# Altium project Tigershark 3D.PrjPcb
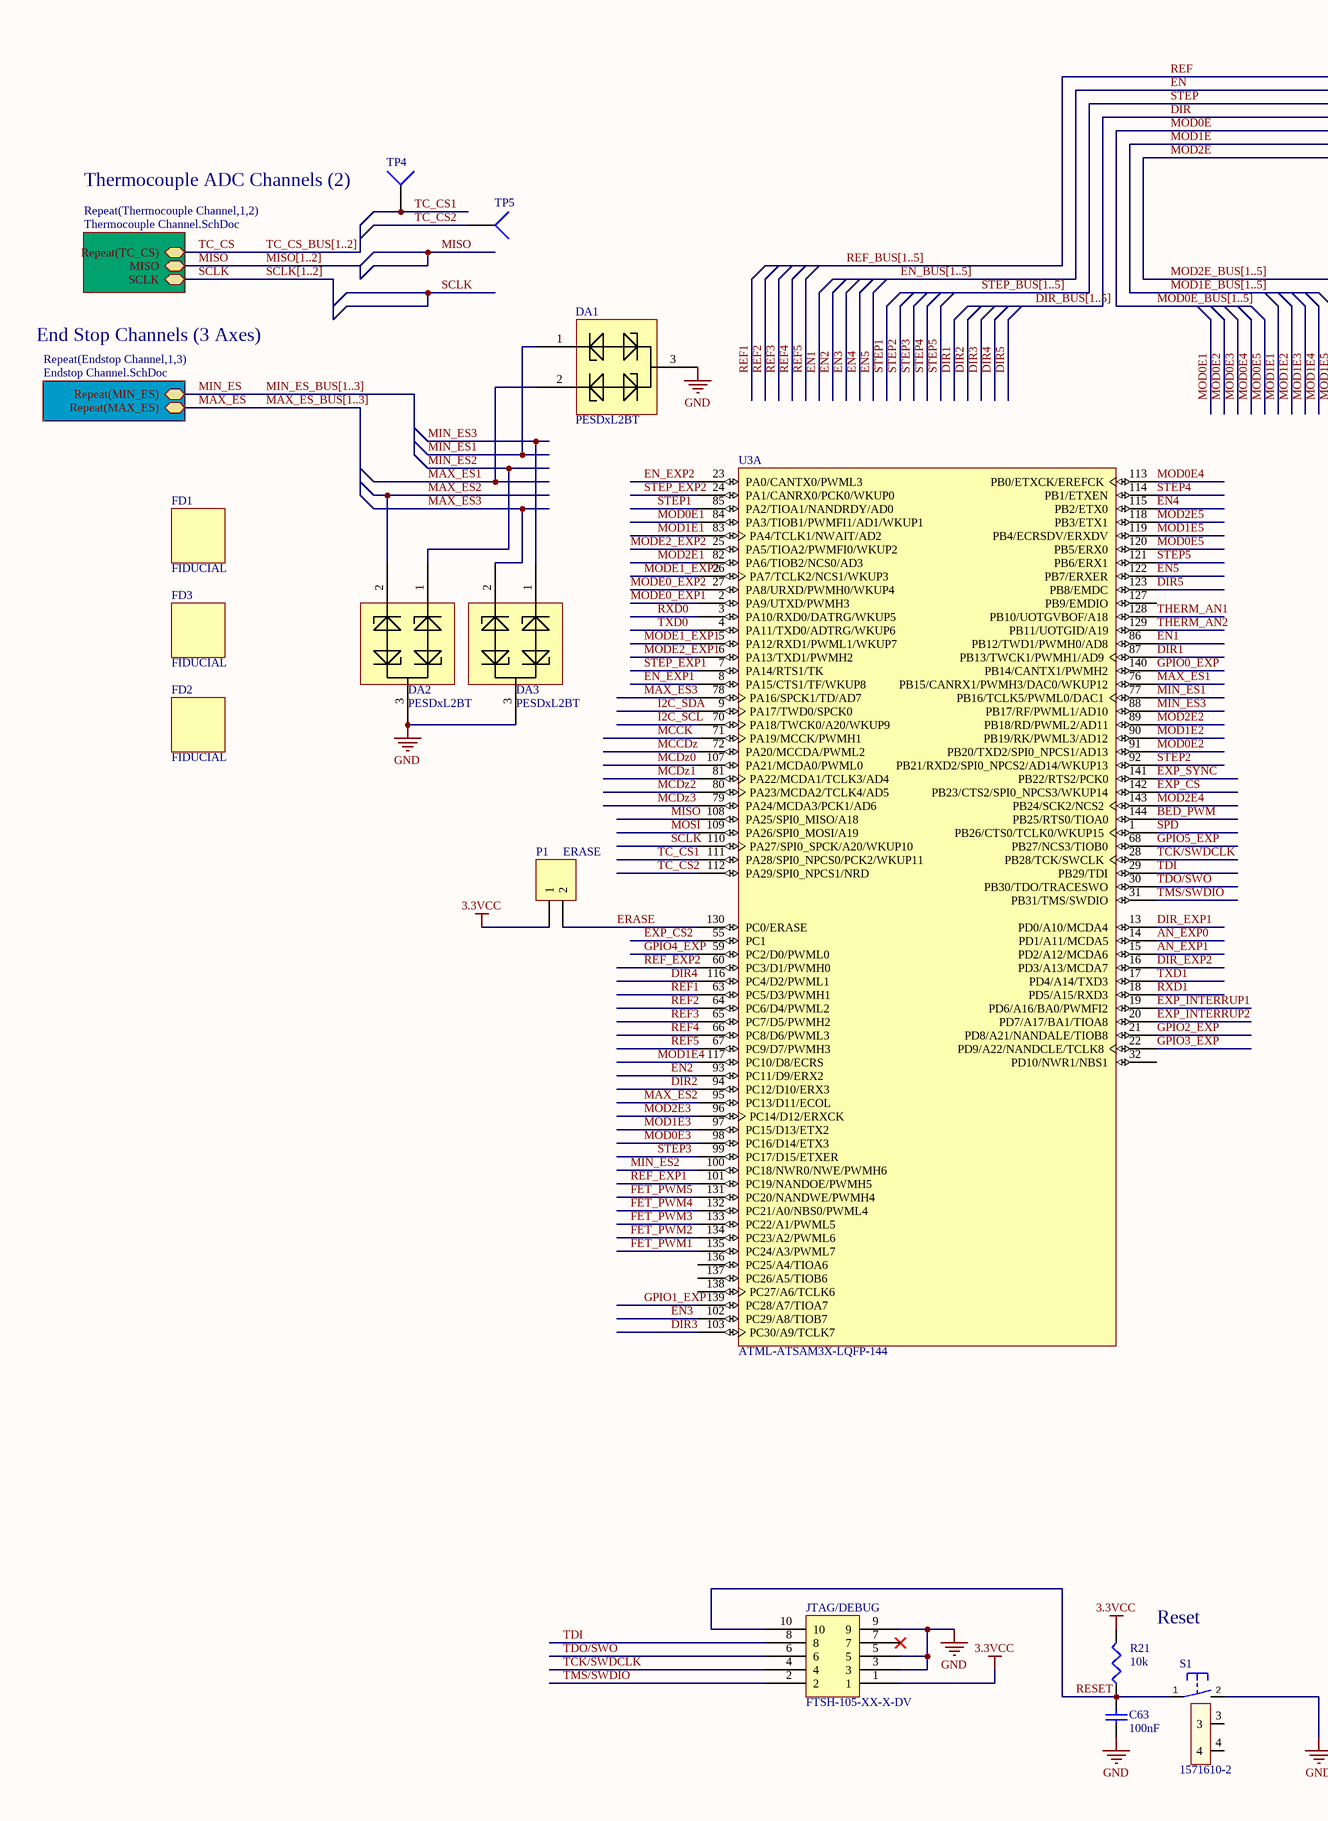
[diagram p0: ATSAM3X8E Main Controller.SchDoc, left]
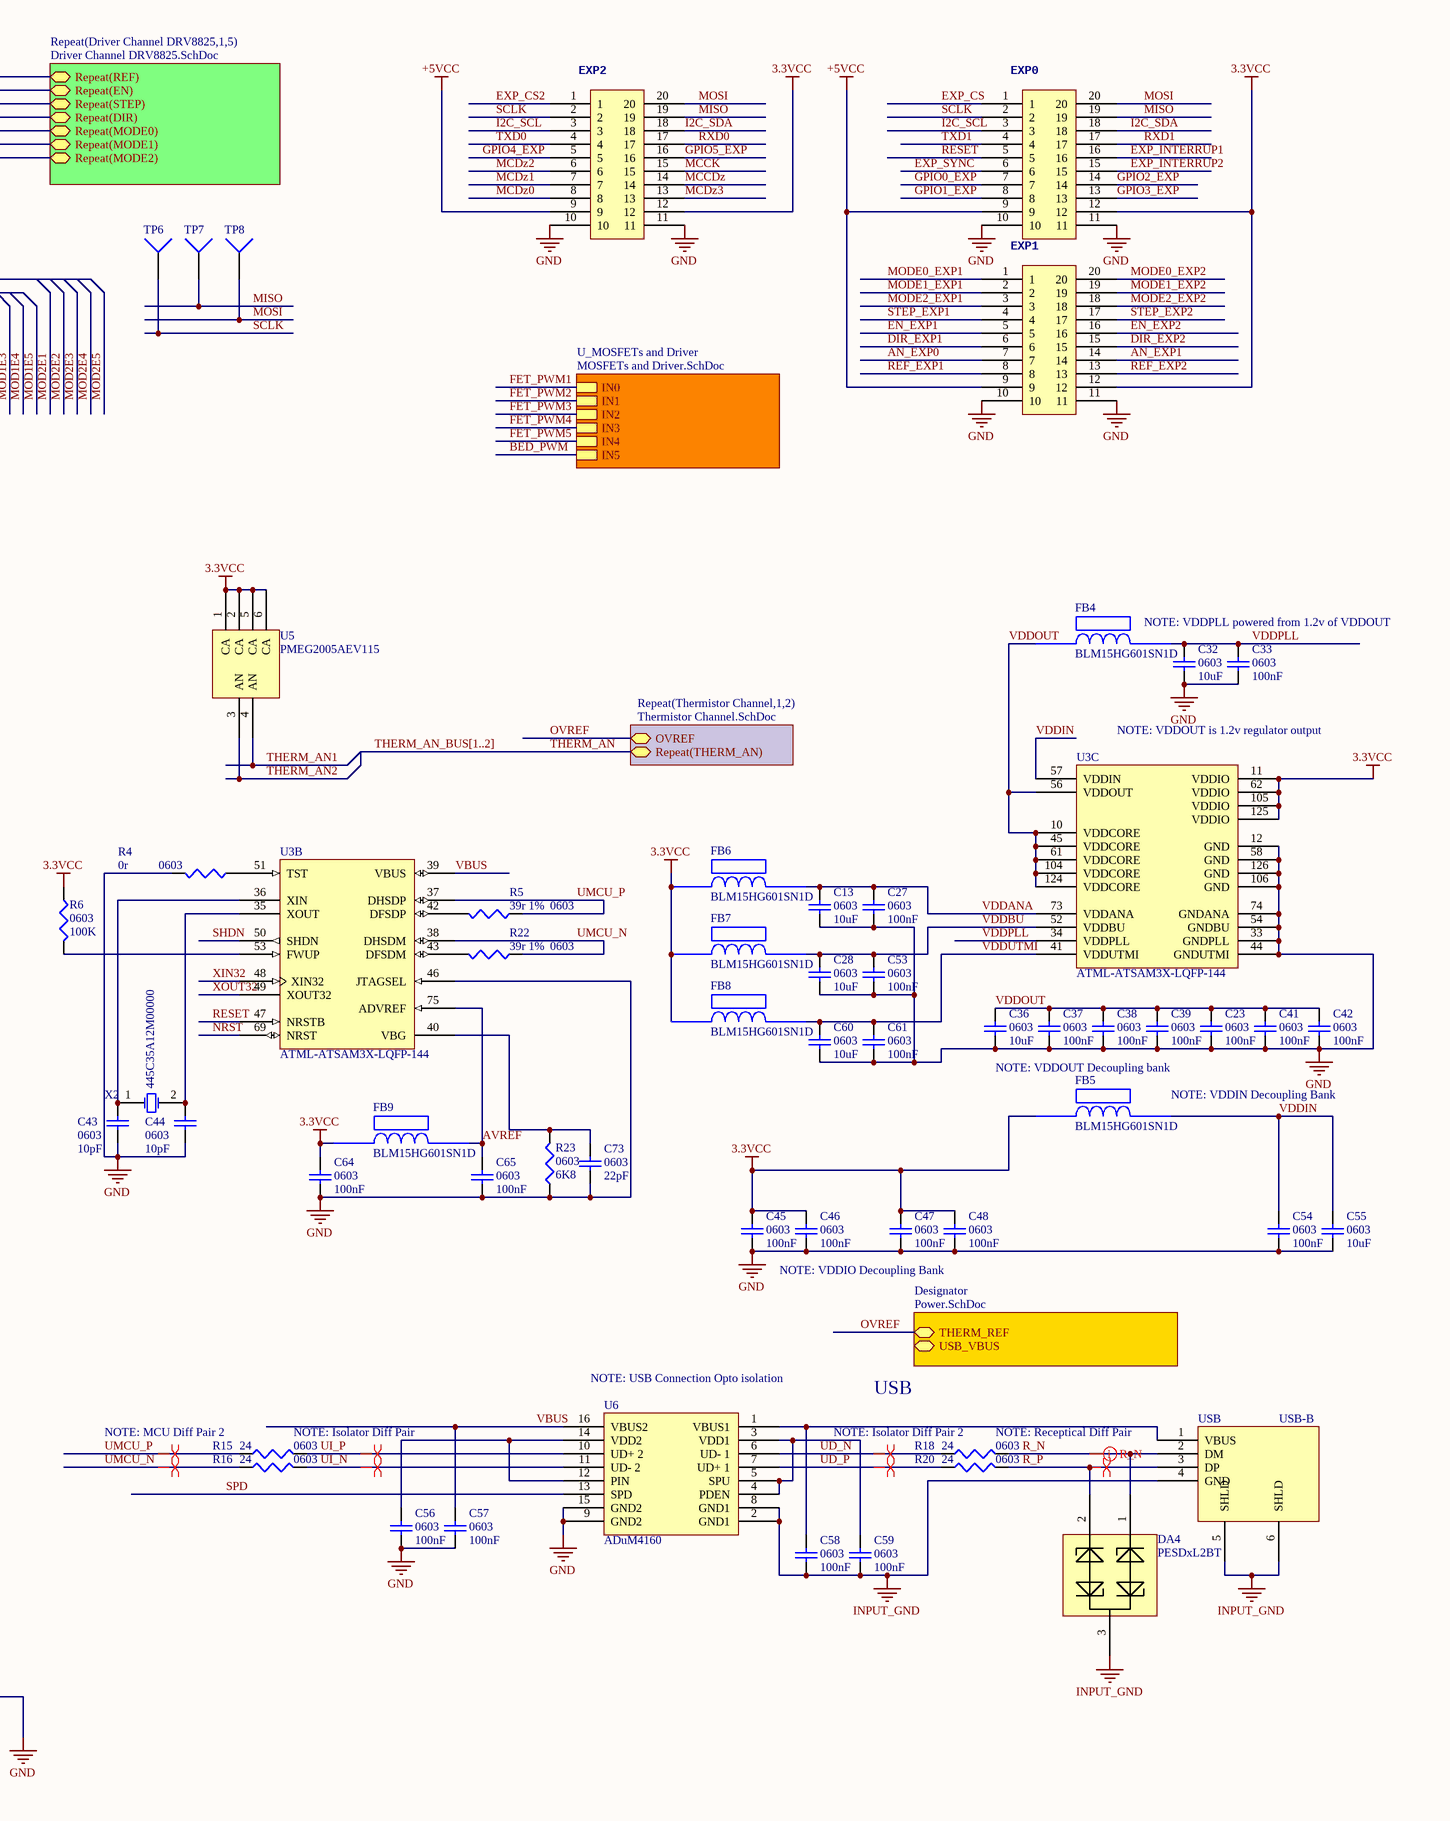
[diagram p1: ATSAM3X8E Main Controller.SchDoc, right]
7 sheets, 307 parts. Net scope: hierarchical (ports join the sheet entries above them; power ports are global).
Board file: Tigershark 3D R1.8.PcbDoc
Sheets:
  ATSAM3X8E Main Controller.SchDoc
    Thermistor Channel1 = Thermistor Channel.SchDoc
    Thermistor Channel2 = Thermistor Channel.SchDoc
    Designator = Power.SchDoc
    Thermocouple Channel1 = Thermocouple Channel.SchDoc
    Thermocouple Channel2 = Thermocouple Channel.SchDoc
    Endstop Channel1 = Endstop Channel.SchDoc
    Endstop Channel2 = Endstop Channel.SchDoc
    Endstop Channel3 = Endstop Channel.SchDoc
    Driver Channel DRV88251 = Driver Channel DRV8825.SchDoc
    Driver Channel DRV88252 = Driver Channel DRV8825.SchDoc
    Driver Channel DRV88253 = Driver Channel DRV8825.SchDoc
    Driver Channel DRV88254 = Driver Channel DRV8825.SchDoc
    Driver Channel DRV88255 = Driver Channel DRV8825.SchDoc
    U_MOSFETs and Driver = MOSFETs and Driver.SchDoc

## Sheet ATSAM3X8E Main Controller.SchDoc
size C

### Parts
(Parts that share a designator on the sheet are numbered #1, #2 ... from top to bottom, then left to right.)
C13  0603  value 10uF  [1608[0603]]
C23  0603  value 100nF  [1608[0603]]
C27  0603  value 100nF  [1608[0603]]
C28  0603  value 10uF  [1608[0603]]
C32  0603  value 10uF  [1608[0603]]
C33  0603  value 100nF  [1608[0603]]
C36  0603  value 10uF  [1608[0603]]
C37  0603  value 100nF  [1608[0603]]
C38  0603  value 100nF  [1608[0603]]
C39  0603  value 100nF  [1608[0603]]
C41  0603  value 100nF  [1608[0603]]
C42  0603  value 100nF  [1608[0603]]
C43  0603  value 10pF  [1608[0603]]
C44  0603  value 10pF  [1608[0603]]
C45  0603  value 100nF  [1608[0603]]
C46  0603  value 100nF  [1608[0603]]
C47  0603  value 100nF  [1608[0603]]
C48  0603  value 100nF  [1608[0603]]
C53  0603  value 100nF  [1608[0603]]
C54  0603  value 100nF  [1608[0603]]
C55  0603  value 10uF  [1608[0603]]
C56  0603  value 100nF  [1608[0603]]
C57  0603  value 100nF  [1608[0603]]
C58  0603  value 100nF  [1608[0603]]
C59  0603  value 100nF  [1608[0603]]
C60  0603  value 10uF  [1608[0603]]
C61  0603  value 100nF  [1608[0603]]
C63  value 100nF  [1608[0603]]  (hidden comment: Cap Semi)
C64  0603  value 100nF  [1608[0603]]
C65  0603  value 100nF  [1608[0603]]
C73  0603  value 22pF  [1608[0603]]
DA1  PESDxL2BT  [SOT95P230X110-3N]
DA2  PESDxL2BT  [SOT95P230X110-3N]
DA3  PESDxL2BT  [SOT95P230X110-3N]
DA4  PESDxL2BT  [SOT95P230X110-3N]
EXP0  10X2-0.1X0.05  [10X2-0.05X0.1w]  (value not drawn)
EXP1  10X2-0.1X0.05  [10X2-0.05X0.1w]  (value not drawn)
EXP2  10X2-0.1X0.05  [10X2-0.05X0.1w]  (value not drawn)
FB4  BLM15HG601SN1D  [BLM18PG121SN1D]
FB5  BLM15HG601SN1D  [BLM18PG121SN1D]
FB6  BLM15HG601SN1D  [BLM18PG121SN1D]
FB7  BLM15HG601SN1D  [BLM18PG121SN1D]
FB8  BLM15HG601SN1D  [BLM18PG121SN1D]
FB9  BLM15HG601SN1D  [BLM18PG121SN1D]
FD1  FIDUCIAL  [FIDUCIAL-1X2]
FD2  FIDUCIAL  [FIDUCIAL-1X2]
FD3  FIDUCIAL  [FIDUCIAL-1X2]
JTAG/DEBUG  FTSH-105-XX-X-DV  [FTSH-105-XX-X-DV]
P1  ERASE  [HDR1X2]
R4  0603  value 0r  [J1-0603]
R5  0603  value 39r 1%  [J1-0603]
R6  0603  value 100K  [J1-0603]
R15  0603  value 24  [J1-0603]
R16  0603  value 24  [J1-0603]
R18  0603  value 24  [J1-0603]
R20  0603  value 24  [J1-0603]
R21  value 10k  [J1-0603]  (hidden comment: Res3)
R22  0603  value 39r 1%  [J1-0603]
R23  0603  value 6K8  [J1-0603]
S1  1571610-2  [B3F-31XX]
TP4  TP4  [TP-2]  (value not drawn)
TP5  TP4  [TP-2]  (value not drawn)
TP6  TP4  [TP-2]  (value not drawn)
TP7  TP4  [TP-2]  (value not drawn)
TP8  TP4  [TP-2]  (value not drawn)
U3#1  ATML-ATSAM3X-LQFP-144  [LQFP144_N]  (parts A,C of 3)
U3#2  ATML-ATSAM3X-LQFP-144  [LQFP144_N]  (part B of 3)
U5  PMEG2005AEV115  [PMEG2005AEV115]
U6  ADuM4160  [ADuM4160]
USB  USB-B  [PN61729]
X2  445C35A12M00000  [445C35A12M00000]

### Sub-sheets
Designator = Power.SchDoc: USB_VBUS (bidir), THERM_REF
Repeat(Driver Channel DRV8825,1,5) = Driver Channel DRV8825.SchDoc: Repeat(REF), Repeat(EN), Repeat(STEP), Repeat(DIR), Repeat(MODE0), Repeat(MODE1), Repeat(MODE2)
Repeat(Endstop Channel,1,3) = Endstop Channel.SchDoc: Repeat(MAX_ES), Repeat(MIN_ES)
Repeat(Thermistor Channel,1,2) = Thermistor Channel.SchDoc: OVREF, Repeat(THERM_AN)
Repeat(Thermocouple Channel,1,2) = Thermocouple Channel.SchDoc: SCLK, MISO, Repeat(TC_CS)
U_MOSFETs and Driver = MOSFETs and Driver.SchDoc: IN0, IN1, IN2, IN3, IN4, IN5

### Nets
3.3VCC: C45.2 C46.2 C47.2 C48.2 C64.2 EXP0.12 EXP1.12 EXP2.12 FB5.1 FB6.1 FB7.1 FB8.1 FB9.1 JTAG/DEBUG.1 P1.1 R6.1 R21.2 U3#1.11(VDDIO) U3#1.62(VDDIO) U3#1.105(VDDIO) U3#1.125(VDDIO) U5.1(CA) U5.2(CA) U5.5(CA) U5.6(CA)
+5VCC: EXP0.9 EXP1.9 EXP2.9
GND: C13.1 C23.1 C27.1 C28.1 C32.1 C33.1 C36.1 C37.1 C38.1 C39.1 C41.1 C42.1 C43.1 C44.1 C45.1 C46.1 C47.1 C48.1 C53.1 C54.1 C55.1 C56.1 C57.1 C60.1 C61.1 C63.1 C64.1 C65.1 C73.1 DA1.3 DA2.3 DA3.3 EXP0.10 EXP0.11 EXP1.10 EXP1.11 EXP2.10 EXP2.11 JTAG/DEBUG.3 JTAG/DEBUG.5 JTAG/DEBUG.9 R4.2 R23.1 S1.2(S) U3#1.12(GND) U3#1.33(GNDPLL) U3#1.44(GNDUTMI) U3#1.54(GNDBU) U3#1.58(GND) U3#1.74(GNDANA) U3#1.106(GND) U3#1.126(GND) U3#2.46(JTAGSEL) U6.9(GND2) U6.15(GND2)
INPUT_GND: C58.1 C59.1 DA4.3 U6.2(GND1) U6.8(GND1) USB.4(GND) USB.5(SHLD) USB.6(SHLD)
AN_EXP0: EXP1.7 U3#1.14(PD1/A11/MCDA5)
AN_EXP1: EXP1.14 U3#1.15(PD2/A12/MCDA6)
AVREF: C65.2 FB9.2 U3#2.75(ADVREF)
BED_PWM: U3#1.144(PB25/RTS0/TIOA0) ; sheet U_MOSFETs and Driver/IN5
DIR: sheet Repeat(Driver Channel DRV8825,1,5)/Repeat(DIR)
DIR1: U3#1.87(PB13/TWCK1/PWMH1/AD9)
DIR2: U3#1.94(PC12/D10/ERX3)
DIR3: U3#1.103(PC30/A9/TCLK7)
DIR4: U3#1.116(PC4/D2/PWML1)
DIR5: U3#1.123(PB8/EMDC)
DIR_EXP1: EXP1.6 U3#1.13(PD0/A10/MCDA4)
DIR_EXP2: EXP1.15 U3#1.16(PD3/A13/MCDA7)
EN: sheet Repeat(Driver Channel DRV8825,1,5)/Repeat(EN)
EN1: U3#1.86(PB12/TWD1/PWMH0/AD8)
EN2: U3#1.93(PC11/D9/ERX2)
EN3: U3#1.102(PC29/A8/TIOB7)
EN4: U3#1.115(PB2/ETX0)
EN5: U3#1.122(PB7/ERXER)
EN_EXP1: EXP1.5 U3#1.8(PA15/CTS1/TF/WKUP8)
EN_EXP2: EXP1.16 U3#1.23(PA0/CANTX0/PWML3)
ERASE: P1.2 U3#1.130(PC0/ERASE)
EXP_CS: EXP0.1 U3#1.142(PB23/CTS2/SPI0_NPCS3/WKUP14)
EXP_CS2: EXP2.1 U3#1.55(PC1)
EXP_INTERRUP1: EXP0.16 U3#1.19(PD6/A16/BA0/PWMFI2)
EXP_INTERRUP2: EXP0.15 U3#1.20(PD7/A17/BA1/TIOA8)
EXP_SYNC: EXP0.6 U3#1.141(PB22/RTS2/PCK0)
FET_PWM1: U3#1.135(PC24/A3/PWML7) ; sheet U_MOSFETs and Driver/IN0
FET_PWM2: U3#1.134(PC23/A2/PWML6) ; sheet U_MOSFETs and Driver/IN1
FET_PWM3: U3#1.133(PC22/A1/PWML5) ; sheet U_MOSFETs and Driver/IN2
FET_PWM4: U3#1.132(PC21/A0/NBS0/PWML4) ; sheet U_MOSFETs and Driver/IN3
FET_PWM5: U3#1.131(PC20/NANDWE/PWMH4) ; sheet U_MOSFETs and Driver/IN4
GPIO0_EXP: EXP0.7 U3#1.140(PB14/CANTX1/PWMH2)
GPIO1_EXP: EXP0.8 U3#1.139(PC28/A7/TIOA7)
GPIO2_EXP: EXP0.14 U3#1.21(PD8/A21/NANDALE/TIOB8)
GPIO3_EXP: EXP0.13 U3#1.22(PD9/A22/NANDCLE/TCLK8)
GPIO4_EXP: EXP2.5 U3#1.59(PC2/D0/PWML0)
GPIO5_EXP: EXP2.16 U3#1.68(PB27/NCS3/TIOB0)
I2C_SCL: EXP0.3 EXP2.3 U3#1.70(PA18/TWCK0/A20/WKUP9)
I2C_SDA: EXP0.18 EXP2.18 U3#1.9(PA17/TWD0/SPCK0)
MAX_ES: sheet Repeat(Endstop Channel,1,3)/Repeat(MAX_ES)
MAX_ES1: DA1.2 U3#1.76(PB15/CANRX1/PWMH3/DAC0/WKUP12)
MAX_ES2: DA2.2 U3#1.95(PC13/D11/ECOL)
MAX_ES3: DA3.2 U3#1.78(PA16/SPCK1/TD/AD7)
MCCDz: EXP2.14 U3#1.72(PA20/MCCDA/PWML2)
MCCK: EXP2.15 U3#1.71(PA19/MCCK/PWMH1)
MCDz0: EXP2.8 U3#1.107(PA21/MCDA0/PWML0)
MCDz1: EXP2.7 U3#1.81(PA22/MCDA1/TCLK3/AD4)
MCDz2: EXP2.6 U3#1.80(PA23/MCDA2/TCLK4/AD5)
MCDz3: EXP2.13 U3#1.79(PA24/MCDA3/PCK1/AD6)
MIN_ES: sheet Repeat(Endstop Channel,1,3)/Repeat(MIN_ES)
MIN_ES1: DA1.1 U3#1.77(PB16/TCLK5/PWML0/DAC1)
MIN_ES2: DA2.1 U3#1.100(PC18/NWR0/NWE/PWMH6)
MIN_ES3: DA3.1 U3#1.88(PB17/RF/PWML1/AD10)
MISO: EXP0.19 EXP2.19 TP7.1 U3#1.108(PA25/SPI0_MISO/A18) ; sheet Repeat(Thermocouple Channel,1,2)/MISO
MOD0E: sheet Repeat(Driver Channel DRV8825,1,5)/Repeat(MODE0)
MOD0E1: U3#1.84(PA3/TIOB1/PWMFI1/AD1/WKUP1)
MOD0E2: U3#1.91(PB20/TXD2/SPI0_NPCS1/AD13)
MOD0E3: U3#1.98(PC16/D14/ETX3)
MOD0E4: U3#1.113(PB0/ETXCK/EREFCK)
MOD0E5: U3#1.120(PB5/ERX0)
MOD1E: sheet Repeat(Driver Channel DRV8825,1,5)/Repeat(MODE1)
MOD1E1: U3#1.83(PA4/TCLK1/NWAIT/AD2)
MOD1E2: U3#1.90(PB19/RK/PWML3/AD12)
MOD1E3: U3#1.97(PC15/D13/ETX2)
MOD1E4: U3#1.117(PC10/D8/ECRS)
MOD1E5: U3#1.119(PB4/ECRSDV/ERXDV)
MOD2E: sheet Repeat(Driver Channel DRV8825,1,5)/Repeat(MODE2)
MOD2E1: U3#1.82(PA6/TIOB2/NCS0/AD3)
MOD2E2: U3#1.89(PB18/RD/PWML2/AD11)
MOD2E3: U3#1.96(PC14/D12/ERXCK)
MOD2E4: U3#1.143(PB24/SCK2/NCS2)
MOD2E5: U3#1.118(PB3/ETX1)
MODE0_EXP1: EXP1.1 U3#1.2(PA9/UTXD/PWMH3)
MODE0_EXP2: EXP1.20 U3#1.27(PA8/URXD/PWMH0/WKUP4)
MODE1_EXP1: EXP1.2 U3#1.5(PA12/RXD1/PWML1/WKUP7)
MODE1_EXP2: EXP1.19 U3#1.26(PA7/TCLK2/NCS1/WKUP3)
MODE2_EXP1: EXP1.3 U3#1.6(PA13/TXD1/PWMH2)
MODE2_EXP2: EXP1.18 U3#1.25(PA5/TIOA2/PWMFI0/WKUP2)
MOSI: EXP0.20 EXP2.20 TP8.1 U3#1.109(PA26/SPI0_MOSI/A19)
NRST: U3#2.69(NRST)
OVREF: sheet Repeat(Thermistor Channel,1,2)/OVREF, sheet Designator/THERM_REF
R_N: DA4.1 R18.2 USB.2(DM)
R_P: DA4.2 R20.2 USB.3(DP)
REF: sheet Repeat(Driver Channel DRV8825,1,5)/Repeat(REF)
REF1: U3#1.63(PC5/D3/PWMH1)
REF2: U3#1.64(PC6/D4/PWML2)
REF3: U3#1.65(PC7/D5/PWMH2)
REF4: U3#1.66(PC8/D6/PWML3)
REF5: U3#1.67(PC9/D7/PWMH3)
REF_EXP1: EXP1.8 U3#1.101(PC19/NANDOE/PWMH5)
REF_EXP2: EXP1.13 U3#1.60(PC3/D1/PWMH0)
RESET: C63.2 EXP0.5 JTAG/DEBUG.10 R21.1 S1.1(P) U3#2.47(NRSTB)
RXD0: EXP2.17 U3#1.3(PA10/RXD0/DATRG/WKUP5)
RXD1: EXP0.17 U3#1.18(PD5/A15/RXD3)
SCLK: EXP0.2 EXP2.2 TP6.1 U3#1.110(PA27/SPI0_SPCK/A20/WKUP10) ; sheet Repeat(Thermocouple Channel,1,2)/SCLK
SHDN: U3#2.50(SHDN)
SPD: U3#1.1(PB26/CTS0/TCLK0/WKUP15) U6.13(SPD)
STEP: sheet Repeat(Driver Channel DRV8825,1,5)/Repeat(STEP)
STEP1: U3#1.85(PA2/TIOA1/NANDRDY/AD0)
STEP2: U3#1.92(PB21/RXD2/SPI0_NPCS2/AD14/WKUP13)
STEP3: U3#1.99(PC17/D15/ETXER)
STEP4: U3#1.114(PB1/ETXEN)
STEP5: U3#1.121(PB6/ERX1)
STEP_EXP1: EXP1.4 U3#1.7(PA14/RTS1/TK)
STEP_EXP2: EXP1.17 U3#1.24(PA1/CANRX0/PCK0/WKUP0)
TC_CS: sheet Repeat(Thermocouple Channel,1,2)/Repeat(TC_CS)
TC_CS1: TP4.1 U3#1.111(PA28/SPI0_NPCS0/PCK2/WKUP11)
TC_CS2: TP5.1 U3#1.112(PA29/SPI0_NPCS1/NRD)
TCK/SWDCLK: JTAG/DEBUG.4 U3#1.28(PB28/TCK/SWCLK)
TDI: JTAG/DEBUG.8 U3#1.29(PB29/TDI)
TDO/SWO: JTAG/DEBUG.6 U3#1.30(PB30/TDO/TRACESWO)
THERM_AN: sheet Repeat(Thermistor Channel,1,2)/Repeat(THERM_AN)
THERM_AN1: U3#1.128(PB10/UOTGVBOF/A18) U5.4(AN)
THERM_AN2: U3#1.129(PB11/UOTGID/A19) U5.3(AN)
TMS/SWDIO: JTAG/DEBUG.2 U3#1.31(PB31/TMS/SWDIO)
TXD0: EXP2.4 U3#1.4(PA11/TXD0/ADTRG/WKUP6)
TXD1: EXP0.4 U3#1.17(PD4/A14/TXD3)
UD_N: R18.1 U6.6(UD-_1)
UD_P: R20.1 U6.7(UD+_1)
UI_N: R16.2 U6.11(UD-_2)
UI_P: R15.2 U6.10(UD+_2)
UMCU_N: R16.1 R22.1 U3#2.38(DHSDM)
UMCU_P: R5.1 R15.1 U3#2.37(DHSDP)
VBUS: C57.2 U3#2.39(VBUS) U6.16(VBUS2)
VDDANA: C13.2 C27.2 FB6.2 U3#1.73(VDDANA)
VDDBU: C28.2 C53.2 FB7.2 U3#1.52(VDDBU)
VDDIN: C54.2 C55.2 FB5.2 U3#1.57(VDDIN)
VDDOUT: C23.2 C36.2 C37.2 C38.2 C39.2 C41.2 C42.2 FB4.1 U3#1.10(VDDCORE) U3#1.45(VDDCORE) U3#1.56(VDDOUT) U3#1.61(VDDCORE) U3#1.104(VDDCORE) U3#1.124(VDDCORE)
VDDPLL: C32.2 C33.2 FB4.2 U3#1.34(VDDPLL)
VDDUTMI: C60.2 C61.2 FB8.2 U3#1.41(VDDUTMI)
XIN32: U3#2.48(XIN32)
XOUT32: U3#2.49(XOUT32)
NetC43_2: C43.2 U3#2.36(XIN) X2.1(OSC1)
NetC44_2: C44.2 U3#2.35(XOUT) X2.2(OSC2)
NetC56_2: C56.2 U6.12(PIN) U6.14(VDD2)
NetC58_2: C58.2 U6.1(VBUS1) USB.1(VBUS)
NetC59_2: C59.2 U6.3(VDD1) U6.4(PDEN) U6.5(SPU)
NetC73_2: C73.2 R23.2 U3#2.40(VBG)
NetR4_1: R4.1 U3#2.51(TST)
NetR5_2: R5.2 U3#2.42(DFSDP)
NetR6_2: R6.2 U3#2.53(FWUP)
NetR22_2: R22.2 U3#2.43(DFSDM)

Not connected (* = marked no-connect by the designer): JTAG/DEBUG 7*; S1 3 4; U3#1 32(PD10/NWR1/NBS1) 127(PB9/EMDIO) 136(PC25/A4/TIOA6) 137(PC26/A5/TIOB6) 138(PC27/A6/TCLK6)

### Buses and harness runs
bus DIR_BUS[1..5]
bus EN_BUS[1..5]
bus MAX_ES_BUS[1..3]
bus MIN_ES_BUS[1..3]
bus MISO[1..2]
bus MOD0E_BUS[1..5]
bus MOD1E_BUS[1..5]
bus MOD2E_BUS[1..5]
bus REF_BUS[1..5]
bus SCLK[1..2]
bus STEP_BUS[1..5]
bus TC_CS_BUS[1..2]
bus THERM_AN_BUS[1..2]

### Layout directives
differential pair: R_N, R_P, UD_N, UD_P, UI_N, UI_P, UMCU_N, UMCU_P

### Notes on the sheet
- (near TP4) Thermocouple ADC Channels (2)
- End Stop Channels (3 Axes)
- NOTE: VDDPLL powered from 1.2v of VDDOUT
- NOTE: VDDOUT is 1.2v regulator output
- NOTE: VDDOUT Decoupling bank
- NOTE: VDDIN Decoupling Bank
- NOTE: VDDIO Decoupling Bank
- (near U6) NOTE: USB Connection Opto isolation
- USB
- NOTE: MCU Diff Pair 2
- (near R15) NOTE: Isolator Diff Pair
- (near R18) NOTE: Isolator Diff Pair 2
- (near R18) NOTE: Receptical Diff Pair
- Reset

### Library data of the parts
C13 C23 C27 C28 C32 C33 C36-C39 C41-C48 C53-C61 C63-C65 C73 = Cap Semi: Capacitor (Semiconductor SIM Model); Published: 8-Jun-2000; LatestRevisionDate: 29-May-2009; LatestRevisionNote: IPC-7351 Footprint Added.; PackageReference: C1206; Publisher: Altium Limited; PackageDescription: Chip Capacitor
DA1-DA4 = PESDxL2BT: PESDxL2BT TVS Diode Array 2x
EXP0-EXP2 = 10X2-0.1X0.05: LastRevisionNote: ImportComponents; Published: 23-Apr-2014; Publisher: UltiMachine; LastRevisionDate: 23-Apr-2014
JTAG/DEBUG = ARM Cortex JTAG-DEBUG Header
P1 = Header 2: Header, 2-Pin; LatestRevisionDate: 17-Jul-2002; LatestRevisionNote: Re-released for DXP Platform.; Publisher: Altium Limited
R4-R6 R15 R16 R18 R20-R23 = Res3: Resistor; Published: 8-Jun-2000; LatestRevisionDate: 29-May-2009; LatestRevisionNote: IPC-7351 Footprint Added.; PackageReference: J1-0603; Publisher: Altium Limited; PackageDescription: Chip Resistor
S1 = 1571610-2_1: SWTCH Momentary Washable; Manufacturer: Omron; Manufacturer: TE; LastRevisionNote: Import; ComponentLink1URL: http://www.te.com/commerce/DocumentDelivery/DDEController?Action=srchrtrv&DocNm=1571610&DocType=Customer+Drawing&DocLang=English; ComponentLink1Description: Datasheet for B3F-31XX; Published: 23-Apr-2014; Publisher: UltiMachine; LastRevisionDate: 23-Apr-2014; ManufacturerPartNumber: 1571610-2; Supplier 1: Mouser; Supplier Part Number 1: 506-1571610-2
TP4-TP8 = Socket: LatestRevisionDate: 17-Jul-2002; LatestRevisionNote: Re-released for DXP Platform.; Publisher: Altium Limited
U6 = ADuM4160: USB Opto Isolator
X2 = XTAL: Crystal Oscillator; Published: 8-Jun-2000; LatestRevisionDate: 17-Jul-2002; LatestRevisionNote: Re-released for DXP Platform.; PackageReference: R38; Publisher: Altium Limited; PackageDescription: Crystal, Thru-Hole; 2 Leads; Body 3.1 x 8.2 mm (Dia.xH)

## Sheet Thermistor Channel.SchDoc
size A
Used 2 times, as channels Thermistor Channel1, Thermistor Channel2. Parts and nets are listed once, with the designators drawn on the sheet.
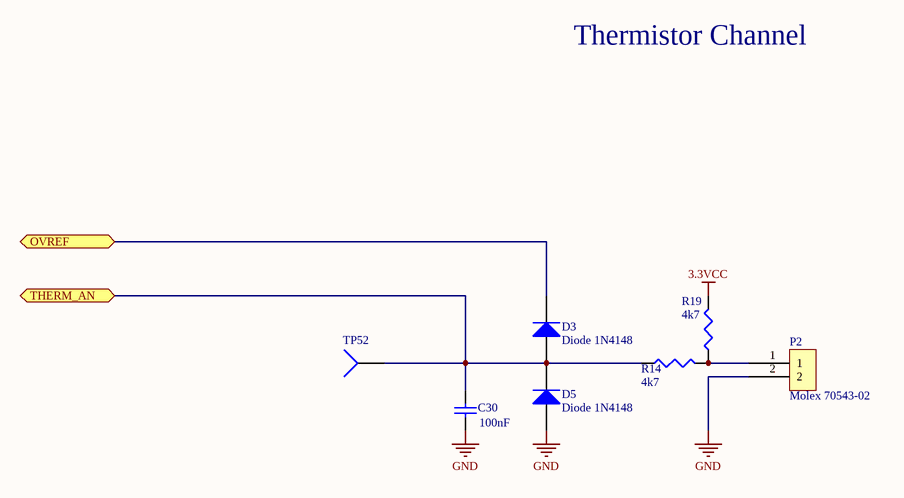
[diagram p2: Thermistor Channel.SchDoc]

### Parts
C30  value 100nF  [1608[0603]]  (hidden comment: Cap Semi)
D3  Diode 1N4148  [1N4148WT]
D5  Diode 1N4148  [1N4148WT]
P2  Molex 70543-02  [70543-02]
R14  value 4k7  [J1-0603]  (hidden comment: Res3)
R19  value 4k7  [J1-0603]  (hidden comment: Res3)
TP52  TP4  [TP-2]  (value not drawn)

### Ports
OVREF, THERM_AN

### Nets
3.3VCC: R19.2
GND: C30.1 D5.1(A) P2.2
OVREF: D3.2(K) ; port OVREF
THERM_AN: C30.2 D3.1(A) D5.2(K) R14.1 TP52.1 ; port THERM_AN
NetP2_1: P2.1 R14.2 R19.1

### Channels
Thermistor Channel1: designators end in _ThermistorChannel1; ports OVREF=OVREF THERM_AN=THERM_AN1
Thermistor Channel2: designators end in _ThermistorChannel2; ports OVREF=OVREF THERM_AN=THERM_AN2

### Notes on the sheet
- Thermistor Channel

### Library data of the parts
C30 = Cap Semi: Capacitor (Semiconductor SIM Model); Published: 8-Jun-2000; LatestRevisionDate: 29-May-2009; LatestRevisionNote: IPC-7351 Footprint Added.; PackageReference: C1206; Publisher: Altium Limited; PackageDescription: Chip Capacitor
D3 D5 = Diode 1N4148: High Conductance Fast Diode; Published: 8-Jun-2000; LatestRevisionDate: 17-Jul-2002; LatestRevisionNote: Re-released for DXP Platform.; DatasheetVersion: 1997; PackageReference: DO-35; Publisher: Altium Limited; PackageDescription: Diode, Axial; Body 3.8 x 1.9 mm (LxDia. max), Lead Dia. 0.53 mm (max); Code_JEDEC: DO-204-AH; ComponentLink1Description: Manufacturer Link; ComponentLink1URL: http://www.fairchildsemi.com/; ComponentLink2Description: Datasheet; ComponentLink2URL: http://www.fairchildsemi.com/ds/1N%2F1N4148.pdf
R14 R19 = Res3: Resistor; Published: 8-Jun-2000; LatestRevisionDate: 29-May-2009; LatestRevisionNote: IPC-7351 Footprint Added.; PackageReference: J1-0603; Publisher: Altium Limited; PackageDescription: Chip Resistor
TP52 = Socket: LatestRevisionDate: 17-Jul-2002; LatestRevisionNote: Re-released for DXP Platform.; Publisher: Altium Limited

## Sheet Power.SchDoc
size B
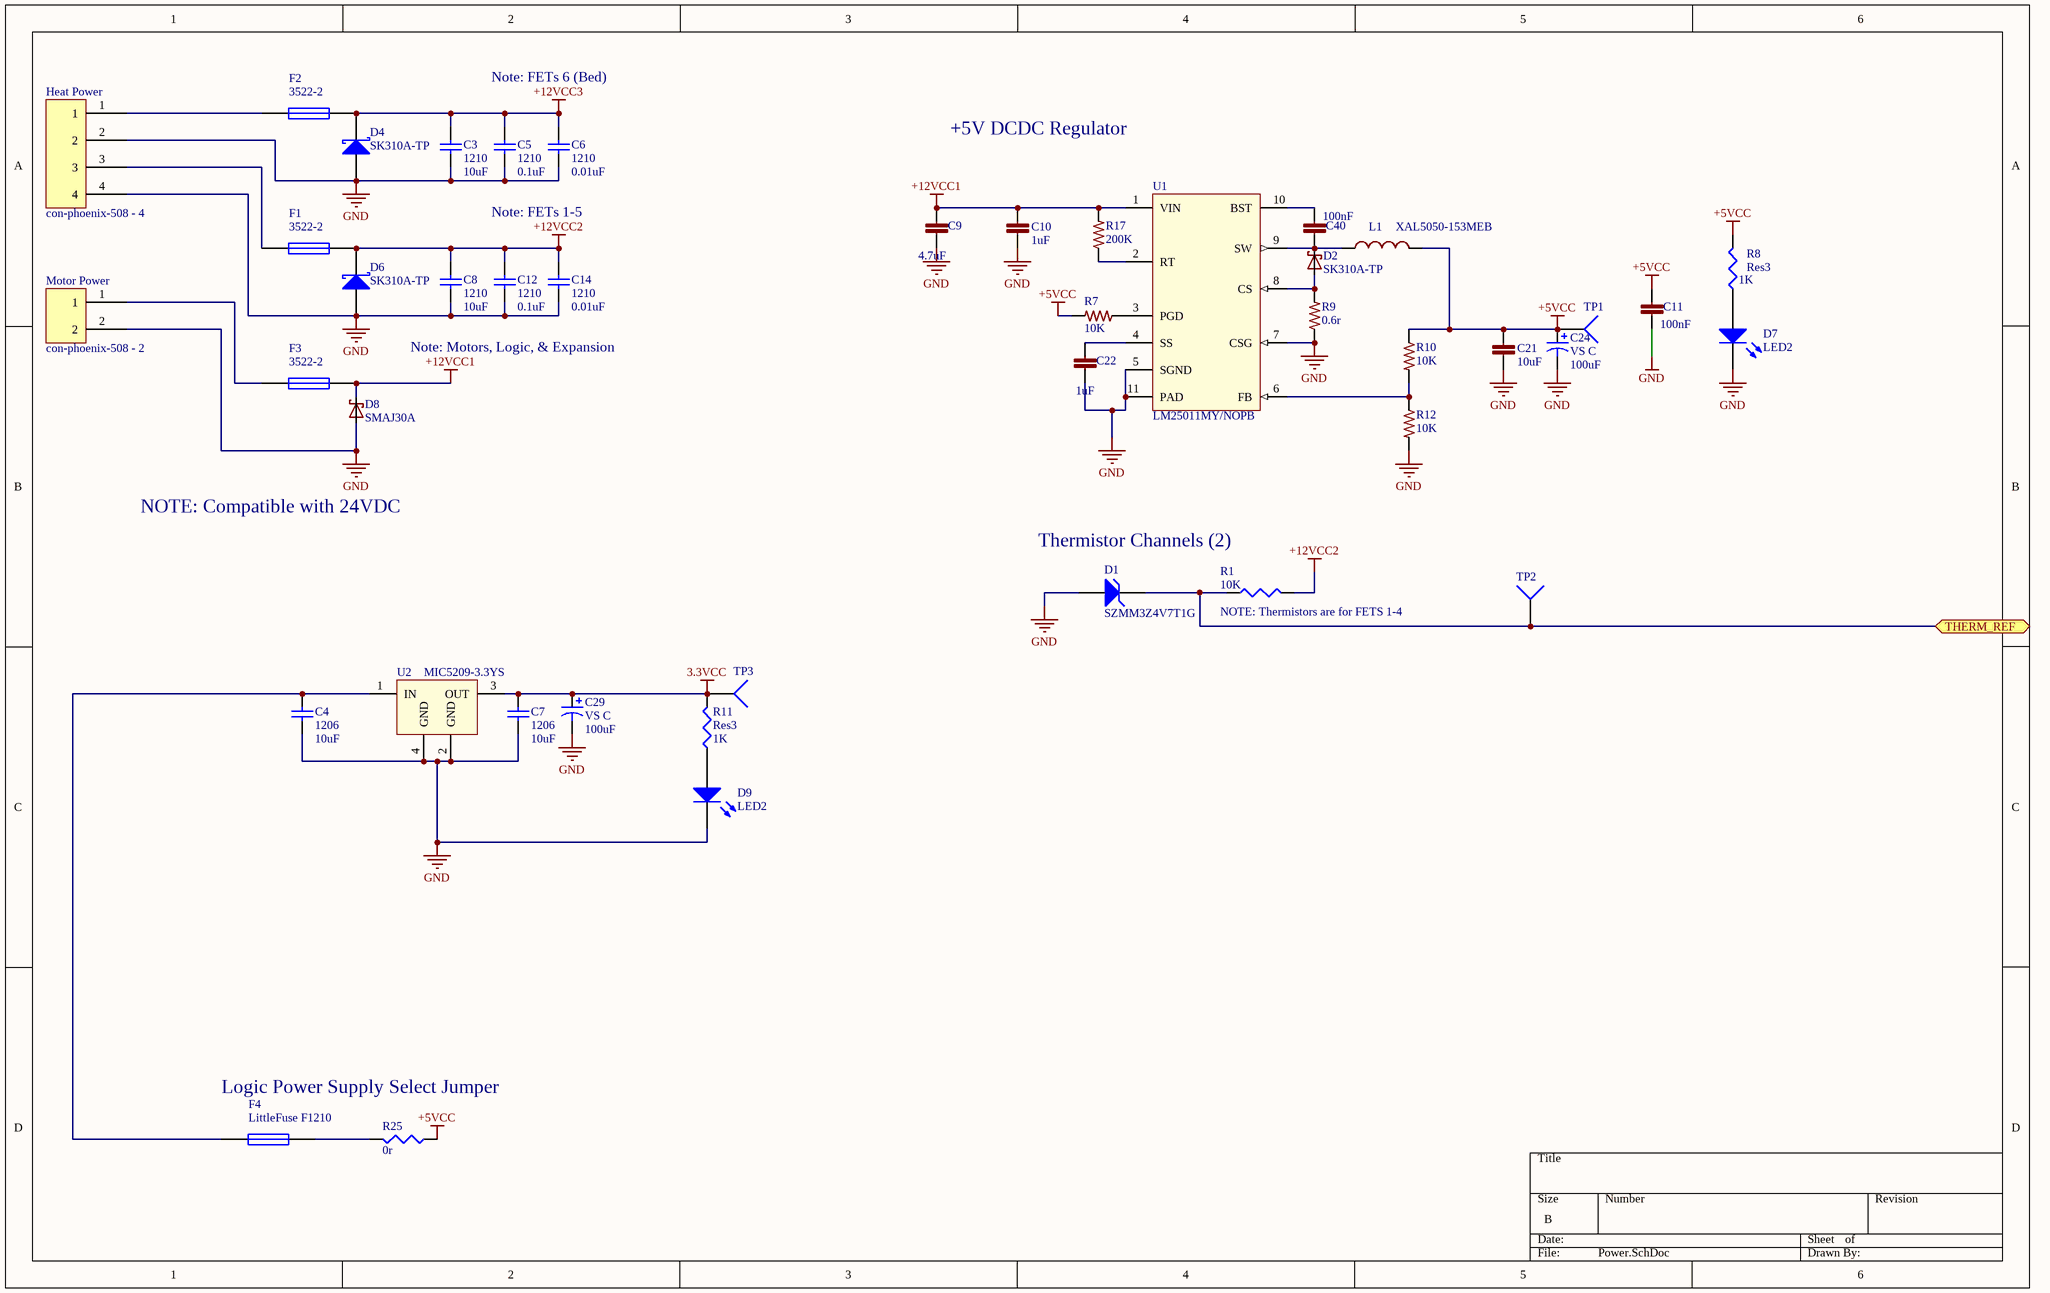
[diagram p3: Power.SchDoc]

### Parts
C3  1210  value 10uF  [C1210]
C4  1206  value 10uF  [C1206]
C5  1210  value 0.1uF  [C1210]
C6  1210  value 0.01uF  [C1210]
C7  1206  value 10uF  [C1206]
C8  1210  value 10uF  [C1210]
C9  4.7uF  [C1206]
C10  1uF  [C0805]
C11  100nF  [C0603]
C12  1210  value 0.1uF  [C1210]
C14  1210  value 0.01uF  [C1210]
C21  10uF  [C0805]
C22  1uF  [C0402]
C24  VS C  value 100uF  [Panasonic VS C]
C29  VS C  value 100uF  [Panasonic VS C]
C40  100nF  [C0603]
D1  SZMM3Z4V7T1G  [SZMM3Z4V7T1G]
D2  SK310A-TP  [SMA-SM]
D4  SK310A-TP  [SK310A-TP]
D6  SK310A-TP  [SK310A-TP]
D7  LED2  [SM 0805 polarized]
D8  SMAJ30A  [SMA-SM]
D9  LED2  [SM 0805 polarized]
F1  3522-2  [3522-2 - WAVE SOLDER]
F2  3522-2  [3522-2 - WAVE SOLDER]
F3  3522-2  [3522-2 - WAVE SOLDER]
F4  LittleFuse F1210  [F1210_M]
Heat_Power  con-phoenix-508 - 4  [MSTBV4]
L1  XAL5050-153MEB  [XAL50xx-153]
Motor_Power  con-phoenix-508 - 2  [MSTBV2 - duplicate]
R1  value 10K  [J1-0603]  (hidden comment: Res3)
R7  10K  [R0603]
R8  Res3  value 1K  [SM 0805 - gap trimmed]
R9  0.6r  [2512R-0.55]
R10  10K  [R0603]
R11  Res3  value 1K  [SM 0805 - gap trimmed]
R12  10K  [R0603]
R17  200K  [R0402]
R25  value 0r  [SM 0805 - gap trimmed]  (hidden comment: Res3)
TP1  TP4  [TP-2]  (value not drawn)
TP2  TP4  [TP-2]  (value not drawn)
TP3  TP4  [TP-2]  (value not drawn)
U1  LM25011MY/NOPB  [VSSOP10]
U2  MIC5209-3.3YS  [SOT230P700X190-4N]

### Ports
THERM_REF

### Nets
3.3VCC: C7.2 C29.1 R11.2 TP3.1 U2.3(OUT)
+5VCC: C11.1 C21.1 C24.1 L1.2 R7.2 R8.2 R10.1 R25.1 TP1.1
+12VCC1: C9.1 C10.1 D8.C F3.2 R17.2 U1.1(VIN)
+12VCC2: C8.2 C12.2 C14.2 D6.2(K) F1.2 R1.2
+12VCC3: C3.2 C5.2 C6.2 D4.2(K) F2.2
GND: C3.1 C4.1 C5.1 C6.1 C7.1 C8.1 C9.2 C10.2 C11.2 C12.1 C14.1 C21.2 C22.2 C24.2 C29.2 D1.1(A) D4.1(A) D6.1(A) D7.1(A) D8.A D9.1(A) Heat_Power.2 Heat_Power.4 Motor_Power.2 R9.1 R12.2 U1.5(SGND) U1.7(CSG) U1.11(PAD) U2.2(GND) U2.4(GND)
OVREF: D1.2(K) R1.1 TP2.1 ; port THERM_REF
NetC4_2: C4.2 F4.1 U2.1(IN)
NetC22_1: C22.1 U1.4(SS)
NetC40_1: C40.1 U1.10(BST)
NetC40_2: C40.2 D2.C L1.1 U1.9(SW)
NetD2_A: D2.A R9.2 U1.8(CS)
NetD7_2: D7.2(K) R8.1
NetD9_2: D9.2(K) R11.1
NetF1_1: F1.1 Heat_Power.3
NetF2_1: F2.1 Heat_Power.1
NetF3_1: F3.1 Motor_Power.1
NetF4_2: F4.2 R25.2
NetR7_1: R7.1 U1.3(PGD)
NetR10_2: R10.2 R12.1 U1.6(FB)
NetR17_1: R17.1 U1.2(RT)

### Notes on the sheet
- Note: FETs 6 (Bed)
- +5V DCDC Regulator
- Note: FETs 1-5
- Note: Motors, Logic, & Expansion
- NOTE: Compatible with 24VDC
- Thermistor Channels (2)
- (near R1) NOTE: Thermistors are for FETS 1-4
- Logic Power Supply Select Jumper

### Library data of the parts
C3-C8 C12 C14 = Cap Semi: Capacitor (Semiconductor SIM Model); Published: 8-Jun-2000; LatestRevisionDate: 29-May-2009; LatestRevisionNote: IPC-7351 Footprint Added.; PackageReference: C1206; Publisher: Altium Limited; PackageDescription: Chip Capacitor
C9 = C1206C475K5PACTU: CAP CER 1206 4.7uF 50V 10% X5R; LastRevisionNote: ImportComponents; Published: 23-Apr-2014; Publisher: UltiMachine; LastRevisionDate: 23-Apr-2014; ManufacturerPartNumber: C1206C475K5PACTU; VALUE: 4.7uF
C10 = GRM21BR71H105KA12L: CAP CER 0805 1uF 50V 10% X7R; LastRevisionNote: ImportComponents; Published: 23-Apr-2014; Publisher: UltiMachine; LastRevisionDate: 23-Apr-2014; ManufacturerPartNumber: GRM21BR71H105KA12L; VALUE: 1uF
C11 C40 = C0603C104K5RACTU: CAP CER 0603 100nF 50V 10% X7R; LastRevisionNote: ImportComponents; LastRevisionDate: 23-Apr-2014; ManufacturerPartNumber: C0603C104K5RACTU; Published: 23-Apr-2014; Publisher: UltiMachine; VALUE: 100nF
C21 = C0805C106K8PACTU: CAP CER 0805 10uF 10V 10% X5R; LastRevisionNote: ImportComponents; Published: 23-Apr-2014; Publisher: UltiMachine; LastRevisionDate: 23-Apr-2014; ManufacturerPartNumber: C0805C106K8PACTU; VALUE: 10uF
C22 = GRM155R60J105KE19D: CAP CER 0402 1uF 6.3V 10% X5R; LastRevisionNote: ImportComponents; Published: 23-Apr-2014; Publisher: UltiMachine; LastRevisionDate: 23-Apr-2014; ManufacturerPartNumber: GRM155R60J105KE19D; VALUE: 1uF
C24 C29 = Cap Pol3: Polarized Capacitor (Surface Mount); Published: 8-Jun-2000; LatestRevisionDate: 29-May-2009; LatestRevisionNote: IPC-7351 Footprint Added.; PackageReference: C0805; Publisher: Altium Limited; PackageDescription: Chip Capacitor
D1 = D Zener: Zener Diode; Published: 8-Jun-2000; LatestRevisionDate: 17-Jul-2002; LatestRevisionNote: Re-released for DXP Platform.; PackageReference: DIODE-0.7; Publisher: Altium Limited; PackageDescription: Diode, Thru-Hole; 2 Leads; 0.7 in Pin Spacing
D2 = SK310A: DIODE Schottky 3A SMA; LastRevisionNote: ImportComponents; LastRevisionDate: 23-Apr-2014; ManufacturerPartNumber: SK310A; Published: 23-Apr-2014; Publisher: UltiMachine
D4 D6 = D Schottky: Schottky Diode; Published: 8-Jun-2000; LatestRevisionDate: 17-Jul-2002; LatestRevisionNote: Re-released for DXP Platform.; PackageReference: SMB; Publisher: Altium Limited; PackageDescription: DO-214-AA/SMB; 2 C-Bend Leads; Body 5.3 x 3.6 mm, inc. leads (LxW); Code_JEDEC: DO-214-AA
D7 D9 = LED2: Typical RED, GREEN, YELLOW, AMBER GaAs LED; Published: 8-Jun-2000; LatestRevisionDate: 17-Jul-2002; LatestRevisionNote: Re-released for DXP Platform.; PackageVersion: Feb-2002; PackageReference: 3.2X1.6X1.1; Publisher: Altium Limited; PackageDescription: SM LED; 2 Flat Leads
D8 = SMAJ30A: DIODE TVS 30V SMA; LastRevisionNote: ImportComponents; Published: 23-Apr-2014; Publisher: UltiMachine; LastRevisionDate: 23-Apr-2014; ManufacturerPartNumber: SMAJ30A
F1-F4 = Fuse 1: Fuse; Published: 8-Jun-2000; LatestRevisionDate: 17-Jul-2002; LatestRevisionNote: Re-released for DXP Platform.; PackageReference: PIN-W2/E2.8; Publisher: Altium Limited; PackageDescription: Thru-Hole; 2 Leads
Heat_Power = con-phoenix-508_4
L1 = XAL5050-153MEB: IND 15uH 3.9A 20%; LastRevisionNote: ImportComponents; Published: 23-Apr-2014; Publisher: UltiMachine; LastRevisionDate: 23-Apr-2014; ManufacturerPartNumber: XAL5050-153MEB; Value: XAL5050-153MEB
Motor_Power = con-phoenix-508_2
R1 R8 R11 R25 = Res3: Resistor; Published: 8-Jun-2000; LatestRevisionDate: 29-May-2009; LatestRevisionNote: IPC-7351 Footprint Added.; PackageReference: J1-0603; Publisher: Altium Limited; PackageDescription: Chip Resistor
R7 R10 R12 = ERJ-3EKF1002V: RES 0603 10K 100mW 1%; LastRevisionNote: ImportComponents; Published: 23-Apr-2014; Publisher: UltiMachine; LastRevisionDate: 23-Apr-2014; ManufacturerPartNumber: ERJ-3EKF1002V; VALUE: 10K
R9 = RL2512FK-070R06L: RES 0.06 OHM 1W 1% 2512 SMD; LastRevisionNote: ImportComponents; Published: 23-Apr-2014; Publisher: UltiMachine; LastRevisionDate: 23-Apr-2014; ManufacturerPartNumber: RL2512FK-070R06L; VALUE: 0.6r
R17 = CRCW0402200KFKED: RES 0402 22r 63mW 1%; LastRevisionNote: ImportComponents; Published: 23-Apr-2014; Publisher: UltiMachine; LastRevisionDate: 23-Apr-2014; ManufacturerPartNumber: CRCW0402200KFKED; VALUE: 200K
TP1-TP3 = Socket: LatestRevisionDate: 17-Jul-2002; LatestRevisionNote: Re-released for DXP Platform.; Publisher: Altium Limited
U1 = LM25011: REG BUCK; Value: LM25011MY/NOPB

## Sheet Thermocouple Channel.SchDoc
size A
Used 2 times, as channels Thermocouple Channel1, Thermocouple Channel2. Parts and nets are listed once, with the designators drawn on the sheet.
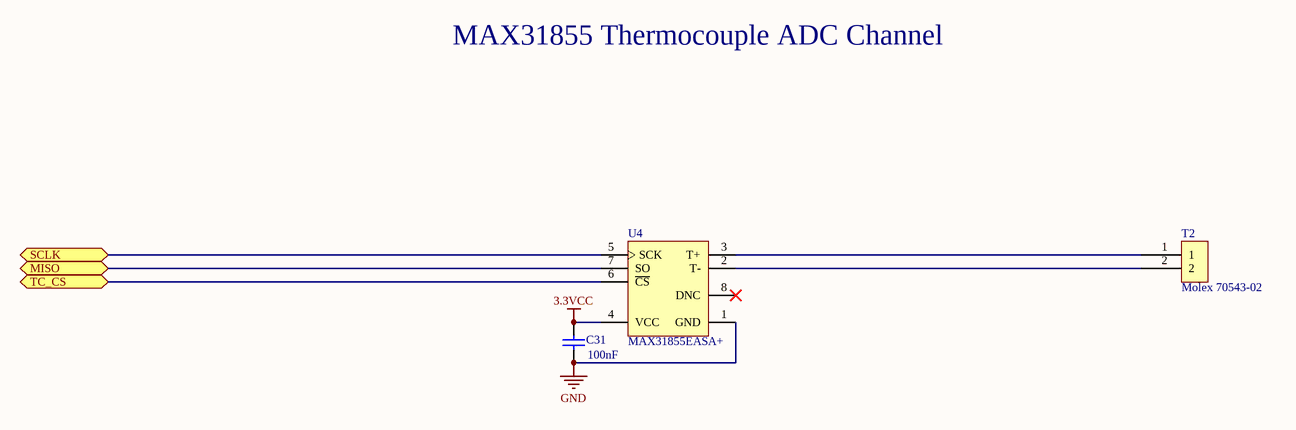
[diagram p4: Thermocouple Channel.SchDoc]

### Parts
C31  value 100nF  [1608[0603]]  (hidden comment: Cap Semi)
T2  Molex 70543-02  [70543-02]
U4  MAX31855EASA+  [MAXM-S8+4_N]

### Ports
MISO, SCLK, TC_CS

### Nets
3.3VCC: C31.2 U4.4(VCC)
GND: C31.1 U4.1(GND)
MISO: U4.7(SO) ; port MISO
SCLK: U4.5(SCK) ; port SCLK
TC_CS: U4.6(~{CS}) ; port TC_CS
NetT2_1: T2.1 U4.3(T+)
NetT2_2: T2.2 U4.2(T-)

Not connected (* = marked no-connect by the designer): U4 8(DNC)*

### Channels
Thermocouple Channel1: designators end in _ThermocoupleChannel1; ports MISO=MISO SCLK=SCLK TC_CS=TC_CS1
Thermocouple Channel2: designators end in _ThermocoupleChannel2; ports MISO=MISO SCLK=SCLK TC_CS=TC_CS2

### Notes on the sheet
- MAX31855 Thermocouple ADC Channel

### Library data of the parts
C31 = Cap Semi: Capacitor (Semiconductor SIM Model); Published: 8-Jun-2000; LatestRevisionDate: 29-May-2009; LatestRevisionNote: IPC-7351 Footprint Added.; PackageReference: C1206; Publisher: Altium Limited; PackageDescription: Chip Capacitor
U4 = MAX31855EASA+: Cold Junction Compensated Thermocouple to Digital Converter, 14 Bits Temperature Resolution, -40 to 125 degC, 8-Pin SOIC (S8+4), Pb-Free; Functions: Thermocouple-to-Digital Converter; Interface: SPI; Parasite Pwr.: No; DatasheetVersion: Rev. 2; PackageVersion: Rev. D, 10/2012; PackageReference: S8+4; PackageDescription: 8-Pin Small-Outline IC, Narrow, Body 3.9 x 4.9 mm, Pitch 1.27 mm; Supplier 1: Digi-Key; Supplier Part Number 1: MAX31855EASA+-ND; Supplier 2: Mouser; Supplier Part Number 2: 700-MAX31855EASA+; Generic Part Number: MAX31855; Mounting Technology: Surface Mount; Code_JEDEC: MS-012; PartNumber: MAX31855EASA+; ComponentLink1Description: Manufacturer URL; ComponentLink1URL: http://www.maximintegrated.com/; ComponentLink2Description: Datasheet; ComponentLink2URL: http://datasheets.maximintegrated.com/en/ds/MAX31855.pdf; ComponentLink3Description: Package Specification; ComponentLink3URL: http://pdfserv.maximintegrated.com/package_dwgs/21-0041.PDF

## Sheet Endstop Channel.SchDoc
size A
Used 3 times, as channels Endstop Channel1, Endstop Channel2, Endstop Channel3. Parts and nets are listed once, with the designators drawn on the sheet.
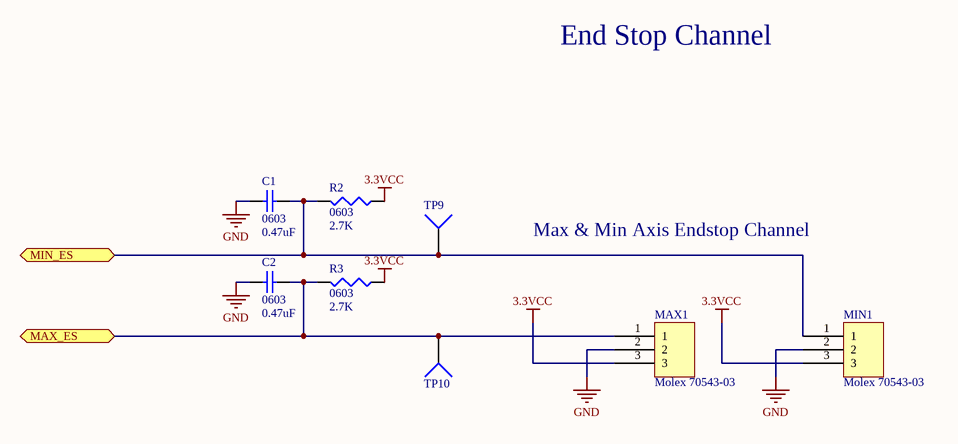
[diagram p5: Endstop Channel.SchDoc]

### Parts
C1  0603  value 0.47uF  [1608[0603]]
C2  0603  value 0.47uF  [1608[0603]]
MAX1  Molex 70543-03  [70543-03]
MIN1  Molex 70543-03  [70543-03]
R2  0603  value 2.7K  [J1-0603]
R3  0603  value 2.7K  [J1-0603]
TP9  TP4  [TP-2]  (value not drawn)
TP10  TP4  [TP-2]  (value not drawn)

### Ports
MAX_ES, MIN_ES

### Nets
3.3VCC: MAX1.3 MIN1.3 R2.1 R3.1
GND: C1.2 C2.2 MAX1.2 MIN1.2
MAX_ES: C2.1 MAX1.1 R3.2 TP10.1 ; port MAX_ES
MIN_ES: C1.1 MIN1.1 R2.2 TP9.1 ; port MIN_ES

### Channels
Endstop Channel1: designators end in _EndstopChannel1; ports MAX_ES=MAX_ES1 MIN_ES=MIN_ES1
Endstop Channel2: designators end in _EndstopChannel2; ports MAX_ES=MAX_ES2 MIN_ES=MIN_ES2
Endstop Channel3: designators end in _EndstopChannel3; ports MAX_ES=MAX_ES3 MIN_ES=MIN_ES3

### Notes on the sheet
- End Stop Channel
- Max & Min Axis Endstop Channel

### Library data of the parts
C1 C2 = Cap Semi: Capacitor (Semiconductor SIM Model); Published: 8-Jun-2000; LatestRevisionDate: 29-May-2009; LatestRevisionNote: IPC-7351 Footprint Added.; PackageReference: C1206; Publisher: Altium Limited; PackageDescription: Chip Capacitor
MAX1 MIN1 = Molex Endstop
R2 R3 = Res3: Resistor; Published: 8-Jun-2000; LatestRevisionDate: 29-May-2009; LatestRevisionNote: IPC-7351 Footprint Added.; PackageReference: J1-0603; Publisher: Altium Limited; PackageDescription: Chip Resistor
TP9 TP10 = Socket: LatestRevisionDate: 17-Jul-2002; LatestRevisionNote: Re-released for DXP Platform.; Publisher: Altium Limited

## Sheet Driver Channel DRV8825.SchDoc
size A
Used 5 times, as channels Driver Channel DRV88251, Driver Channel DRV88252, Driver Channel DRV88253, Driver Channel DRV88254, Driver Channel DRV88255. Parts and nets are listed once, with the designators drawn on the sheet.
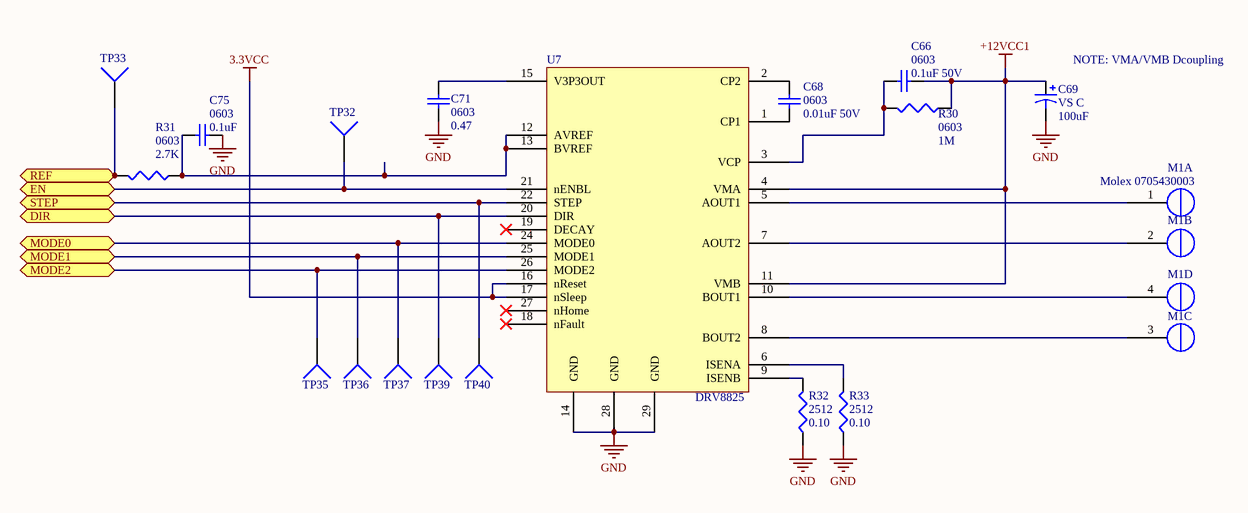
[diagram p6: Driver Channel DRV8825.SchDoc]

### Parts
C66  0603  value 0.1uF 50V  [1608[0603]]
C68  0603  value 0.01uF 50V  [1608[0603]]
C69  VS C  value 100uF  [Panasonic VS C]
C71  0603  value 0.47  [1608[0603]]
C75  0603  value 0.1uF  [1608[0603]]
M1  Molex 0705430003  [4POL254]  (parts A,B,C,D of 4)
R30  0603  value 1M  [J1-0603]
R31  0603  value 2.7K  [J1-0603]
R32  2512  value 0.10  [Resistor2512]
R33  2512  value 0.10  [Resistor2512]
TP32  TP4  [TP-2]  (value not drawn)
TP33  TP4  [TP-2]  (value not drawn)
TP35  TP4  [TP-2]  (value not drawn)
TP36  TP4  [TP-2]  (value not drawn)
TP37  TP4  [TP-2]  (value not drawn)
TP39  TP4  [TP-2]  (value not drawn)
TP40  TP4  [TP-2]  (value not drawn)
U7  DRV8825  [DRV8825]

### Ports
DIR, EN, MODE0, MODE1, MODE2, REF, STEP

### Nets
3.3VCC: U7.16(nReset) U7.17(nSleep)
+12VCC1: C66.1 C69.1 R30.1 U7.4(VMA) U7.11(VMB)
GND: C69.2 C71.1 C75.1 R32.1 R33.1 U7.14(GND) U7.28(GND) U7.29(GND)
DIR: TP39.1 U7.20(DIR) ; port DIR
EN: TP32.1 U7.21(nENBL) ; port EN
MODE0: TP37.1 U7.24(MODE0) ; port MODE0
MODE1: TP36.1 U7.25(MODE1) ; port MODE1
MODE2: TP35.1 U7.26(MODE2) ; port MODE2
REF: R31.2 TP33.1 ; port REF
STEP: TP40.1 U7.22(STEP) ; port STEP
NetC66_2: C66.2 R30.2 U7.3(VCP)
NetC68_1: C68.1 U7.1(CP1)
NetC68_2: C68.2 U7.2(CP2)
NetC71_2: C71.2 U7.15(V3P3OUT)
NetC75_2: C75.2 R31.1 U7.12(AVREF) U7.13(BVREF)
NetM1_1: M1.1(OUT2B) U7.5(AOUT1)
NetM1_2: M1.2(OUT2A) U7.7(AOUT2)
NetM1_3: M1.3(OUT1A) U7.8(BOUT2)
NetM1_4: M1.4(OUT1B) U7.10(BOUT1)
NetR32_2: R32.2 U7.9(ISENB)
NetR33_2: R33.2 U7.6(ISENA)

Not connected (* = marked no-connect by the designer): U7 18(nFault)* 19(DECAY)* 23(NC) 27(nHome)*

### Channels
Driver Channel DRV88251: designators end in _DriverChannelDRV88251; ports DIR=DIR1 EN=EN1 MODE0=MOD0E1 MODE1=MOD1E1 MODE2=MOD2E1 REF=REF1 STEP=STEP1
Driver Channel DRV88252: designators end in _DriverChannelDRV88252; ports DIR=DIR2 EN=EN2 MODE0=MOD0E2 MODE1=MOD1E2 MODE2=MOD2E2 REF=REF2 STEP=STEP2
Driver Channel DRV88253: designators end in _DriverChannelDRV88253; ports DIR=DIR3 EN=EN3 MODE0=MOD0E3 MODE1=MOD1E3 MODE2=MOD2E3 REF=REF3 STEP=STEP3
Driver Channel DRV88254: designators end in _DriverChannelDRV88254; ports DIR=DIR4 EN=EN4 MODE0=MOD0E4 MODE1=MOD1E4 MODE2=MOD2E4 REF=REF4 STEP=STEP4
Driver Channel DRV88255: designators end in _DriverChannelDRV88255; ports DIR=DIR5 EN=EN5 MODE0=MOD0E5 MODE1=MOD1E5 MODE2=MOD2E5 REF=REF5 STEP=STEP5

### Notes on the sheet
- (near C69) NOTE: VMA/VMB Dcoupling

### Library data of the parts
C66 C68 C71 C75 = Cap Semi: Capacitor (Semiconductor SIM Model); Published: 8-Jun-2000; LatestRevisionDate: 29-May-2009; LatestRevisionNote: IPC-7351 Footprint Added.; PackageReference: C1206; Publisher: Altium Limited; PackageDescription: Chip Capacitor
C69 = Cap Pol1: Polarized Capacitor (Radial); Published: 8-Jun-2000; LatestRevisionDate: 17-Jul-2002; LatestRevisionNote: Re-released for DXP Platform.; PackageReference: RB7.6-15; Publisher: Altium Limited; PackageDescription: Polarized Capacitor (Radial); 2 Leads
M1 = Molex 0705430003 Alt: Molex 4 Pin Clip Connector
R30-R33 = Res3: Resistor; Published: 8-Jun-2000; LatestRevisionDate: 29-May-2009; LatestRevisionNote: IPC-7351 Footprint Added.; PackageReference: J1-0603; Publisher: Altium Limited; PackageDescription: Chip Resistor
TP32 TP33 TP35-TP37 TP39 TP40 = Socket: LatestRevisionDate: 17-Jul-2002; LatestRevisionNote: Re-released for DXP Platform.; Publisher: Altium Limited
U7 = DRV8825: DRV8825 Ti Stepper Driver

## Sheet MOSFETs and Driver.SchDoc
size B
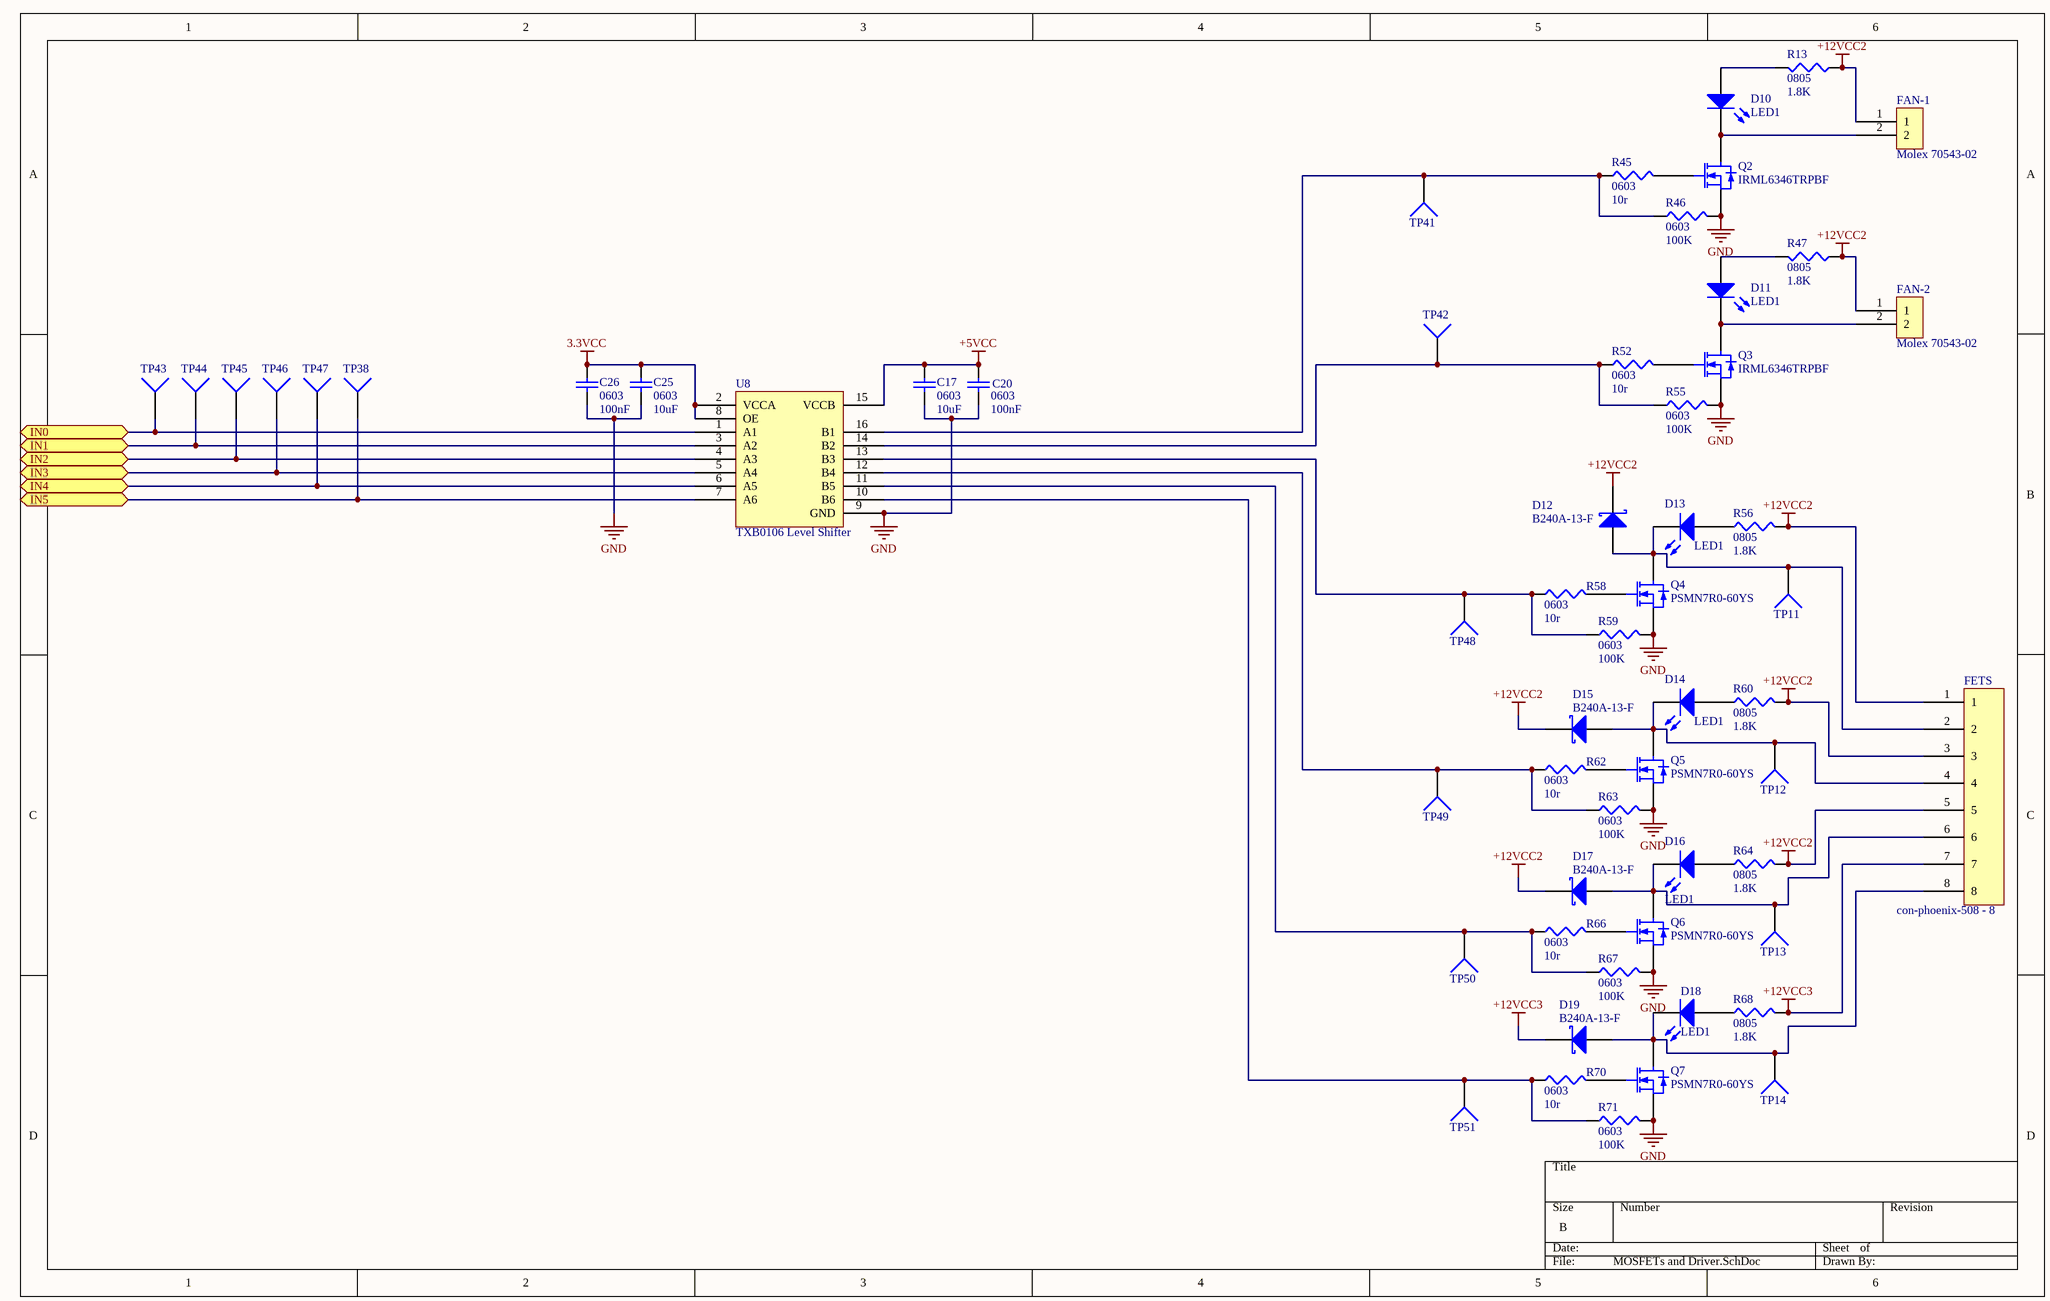
[diagram p7: MOSFETs and Driver.SchDoc]

### Parts
C17  0603  value 10uF  [1608[0603]]
C20  0603  value 100nF  [1608[0603]]
C25  0603  value 10uF  [1608[0603]]
C26  0603  value 100nF  [1608[0603]]
D10  LED1  [SM 0805 polarized]
D11  LED1  [SM 0805 polarized]
D12  B240A-13-F  [SK310A-TP]
D13  LED1  [SM 0805 polarized]
D14  LED1  [SM 0805 polarized]
D15  B240A-13-F  [SK310A-TP]
D16  LED1  [SM 0805 polarized]
D17  B240A-13-F  [SK310A-TP]
D18  LED1  [SM 0805 polarized]
D19  B240A-13-F  [SK310A-TP]
FAN-1  Molex 70543-02  [70543-02]
FAN-2  Molex 70543-02  [70543-02]
FETS  con-phoenix-508 - 8  [MSTBV4]
Q2  IRML6346TRPBF  [IRLML6346]
Q3  IRML6346TRPBF  [IRLML6346]
Q4  PSMN7R0-60YS  [PSMN7R0-60YS]
Q5  PSMN7R0-60YS  [PSMN7R0-60YS]
Q6  PSMN7R0-60YS  [PSMN7R0-60YS]
Q7  PSMN7R0-60YS  [PSMN7R0-60YS]
R13  0805  value 1.8K  [SM 0805 - gap trimmed]
R45  0603  value 10r  [J1-0603]
R46  0603  value 100K  [J1-0603]
R47  0805  value 1.8K  [SM 0805 - gap trimmed]
R52  0603  value 10r  [J1-0603]
R55  0603  value 100K  [J1-0603]
R56  0805  value 1.8K  [SM 0805 - gap trimmed]
R58  0603  value 10r  [J1-0603]
R59  0603  value 100K  [J1-0603]
R60  0805  value 1.8K  [SM 0805 - gap trimmed]
R62  0603  value 10r  [J1-0603]
R63  0603  value 100K  [J1-0603]
R64  0805  value 1.8K  [SM 0805 - gap trimmed]
R66  0603  value 10r  [J1-0603]
R67  0603  value 100K  [J1-0603]
R68  0805  value 1.8K  [SM 0805 - gap trimmed]
R70  0603  value 10r  [J1-0603]
R71  0603  value 100K  [J1-0603]
TP11  TP4  [TP-2]  (value not drawn)
TP12  TP4  [TP-2]  (value not drawn)
TP13  TP4  [TP-2]  (value not drawn)
TP14  TP4  [TP-2]  (value not drawn)
TP38  TP4  [TP-2]  (value not drawn)
TP41  TP4  [TP-2]  (value not drawn)
TP42  TP4  [TP-2]  (value not drawn)
TP43  TP4  [TP-2]  (value not drawn)
TP44  TP4  [TP-2]  (value not drawn)
TP45  TP4  [TP-2]  (value not drawn)
TP46  TP4  [TP-2]  (value not drawn)
TP47  TP4  [TP-2]  (value not drawn)
TP48  TP4  [TP-2]  (value not drawn)
TP49  TP4  [TP-2]  (value not drawn)
TP50  TP4  [TP-2]  (value not drawn)
TP51  TP4  [TP-2]  (value not drawn)
U8  TXB0106 Level Shifter  [TSOP65P640X120-16N]

### Ports
IN0, IN1, IN2, IN3, IN4, IN5

### Nets
3.3VCC: C25.2 C26.1 U8.2(VCCA) U8.8(OE)
+5VCC: C17.1 C20.1 U8.15(VCCB)
+12VCC2: D12.2(K) D15.2(K) D17.2(K) FAN-1.1 FAN-2.1 FETS.1 FETS.3 FETS.5 R13.1 R47.1 R56.2 R60.2 R64.2
+12VCC3: D19.2(K) FETS.7 R68.2
GND: C17.2 C20.2 C25.1 C26.2 Q2.2(S) Q3.2(S) Q4.1(S) Q4.2(S) Q4.3(S) Q5.1(S) Q5.2(S) Q5.3(S) Q6.1(S) Q6.2(S) Q6.3(S) Q7.1(S) Q7.2(S) Q7.3(S) R46.2 R55.2 R59.2 R63.2 R67.2 R71.2 U8.9(GND)
BED_PWM: TP38.1 U8.7(A6) ; port IN5
FET_PWM1: TP43.1 U8.1(A1) ; port IN0
FET_PWM2: TP44.1 U8.3(A2) ; port IN1
FET_PWM3: TP45.1 U8.4(A3) ; port IN2
FET_PWM4: TP46.1 U8.5(A4) ; port IN3
FET_PWM5: TP47.1 U8.6(A5) ; port IN4
NetD10_1: D10.1(A) FAN-1.2 Q2.3(D)
NetD10_2: D10.2(K) R13.2
NetD11_1: D11.1(A) FAN-2.2 Q3.3(D)
NetD11_2: D11.2(K) R47.2
NetD12_1: D12.1(A) D13.1(A) FETS.2 Q4.5(D) TP11.1
NetD13_2: D13.2(K) R56.1
NetD14_1: D14.1(A) D15.1(A) FETS.4 Q5.5(D) TP12.1
NetD14_2: D14.2(K) R60.1
NetD16_1: D16.1(A) D17.1(A) FETS.6 Q6.5(D) TP13.1
NetD16_2: D16.2(K) R64.1
NetD18_1: D18.1(A) D19.1(A) FETS.8 Q7.5(D) TP14.1
NetD18_2: D18.2(K) R68.1
NetQ2_1: Q2.1(G) R45.2
NetQ3_1: Q3.1(G) R52.2
NetQ4_4: Q4.4(G) R58.2
NetQ5_4: Q5.4(G) R62.2
NetQ6_4: Q6.4(G) R66.2
NetQ7_4: Q7.4(G) R70.2
NetR45_1: R45.1 R46.1 TP41.1 U8.16(B1)
NetR52_1: R52.1 R55.1 TP42.1 U8.14(B2)
NetR58_1: R58.1 R59.1 TP48.1 U8.13(B3)
NetR62_1: R62.1 R63.1 TP49.1 U8.12(B4)
NetR66_1: R66.1 R67.1 TP50.1 U8.11(B5)
NetR70_1: R70.1 R71.1 TP51.1 U8.10(B6)

### Library data of the parts
C17 C20 C25 C26 = Cap Semi: Capacitor (Semiconductor SIM Model); Published: 8-Jun-2000; LatestRevisionDate: 29-May-2009; LatestRevisionNote: IPC-7351 Footprint Added.; PackageReference: C1206; Publisher: Altium Limited; PackageDescription: Chip Capacitor
D10 D11 D13 D14 D16 D18 = LED1: Typical RED GaAs LED; Published: 8-Jun-2000; LatestRevisionDate: 08-Jul-2005; LatestRevisionNote: Mech Layer 1 removed.; PackageReference: LED-1; Publisher: Altium Limited; PackageDescription: LED; 2 Leads
D12 D15 D17 D19 = D Schottky: Schottky Diode; Published: 8-Jun-2000; LatestRevisionDate: 17-Jul-2002; LatestRevisionNote: Re-released for DXP Platform.; PackageReference: SMB; Publisher: Altium Limited; PackageDescription: DO-214-AA/SMB; 2 C-Bend Leads; Body 5.3 x 3.6 mm, inc. leads (LxW); Code_JEDEC: DO-214-AA
FETS = con-phoenix-508
Q2 Q3 = IRML6346TRPBF: N-Channel MOSFET; Published: 8-Jun-2000; LatestRevisionDate: 17-Jul-2002; LatestRevisionNote: Re-released for DXP Platform.; PackageVersion: 1995/1996; PackageReference: E3; Publisher: Altium Limited; PackageDescription: TO, Flat Index; 3 In-Line, Axial Leads; Body Dia. 4.6mm; Lead Dia. 0.5 mm (max)
Q4-Q7 = PSMN7R0-60YS: N-Channel MOSFET; Published: 8-Jun-2000; LatestRevisionDate: 17-Jul-2002; LatestRevisionNote: Re-released for DXP Platform.; PackageVersion: 1995/1996; PackageReference: E3; Publisher: Altium Limited; PackageDescription: TO, Flat Index; 3 In-Line, Axial Leads; Body Dia. 4.6mm; Lead Dia. 0.5 mm (max)
R13 R45-R47 R52 R55 R56 R58-R60 R62-R64 R66-R68 R70 R71 = Res3: Resistor; Published: 8-Jun-2000; LatestRevisionDate: 29-May-2009; LatestRevisionNote: IPC-7351 Footprint Added.; PackageReference: J1-0603; Publisher: Altium Limited; PackageDescription: Chip Resistor
TP11-TP14 TP38 TP41-TP51 = Socket: LatestRevisionDate: 17-Jul-2002; LatestRevisionNote: Re-released for DXP Platform.; Publisher: Altium Limited
U8 = TXB0106: TXB0106 - Bidriectional Opendrain/pushpull level shift

## Nets that join several sheets
3.3VCC: ATSAM3X8E Main Controller (25 pins), Thermistor Channel1 (R19_ThermistorChannel1.2), Thermistor Channel2 (R19_ThermistorChannel2.2), Power (5 pins), Thermocouple Channel1 (C31_ThermocoupleChannel1.2 U4_ThermocoupleChannel1.4), Thermocouple Channel2 (C31_ThermocoupleChannel2.2 U4_ThermocoupleChannel2.4), Endstop Channel1 (MAX1_EndstopChannel1.3 MIN1_EndstopChannel1.3 R2_EndstopChannel1.1 R3_EndstopChannel1.1), Endstop Channel2 (MAX1_EndstopChannel2.3 MIN1_EndstopChannel2.3 R2_EndstopChannel2.1 R3_EndstopChannel2.1), Endstop Channel3 (MAX1_EndstopChannel3.3 MIN1_EndstopChannel3.3 R2_EndstopChannel3.1 R3_EndstopChannel3.1), Driver Channel DRV88251 (U7_DriverChannelDRV88251.16 U7_DriverChannelDRV88251.17), Driver Channel DRV88252 (U7_DriverChannelDRV88252.16 U7_DriverChannelDRV88252.17), Driver Channel DRV88253 (U7_DriverChannelDRV88253.16 U7_DriverChannelDRV88253.17), Driver Channel DRV88254 (U7_DriverChannelDRV88254.16 U7_DriverChannelDRV88254.17), Driver Channel DRV88255 (U7_DriverChannelDRV88255.16 U7_DriverChannelDRV88255.17), MOSFETs and Driver (C25.2 C26.1 U8.2 U8.8)
+5VCC: ATSAM3X8E Main Controller (EXP0.9 EXP1.9 EXP2.9), Power (9 pins), MOSFETs and Driver (C17.1 C20.1 U8.15)
+12VCC1: Power (6 pins), Driver Channel DRV88251 (5 pins), Driver Channel DRV88252 (5 pins), Driver Channel DRV88253 (5 pins), Driver Channel DRV88254 (5 pins), Driver Channel DRV88255 (5 pins)
+12VCC2: Power (6 pins), MOSFETs and Driver (13 pins)
+12VCC3: Power (5 pins), MOSFETs and Driver (D19.2 FETS.7 R68.2)
GND: ATSAM3X8E Main Controller (55 pins), Thermistor Channel1 (C30_ThermistorChannel1.1 D5_ThermistorChannel1.1 P2_ThermistorChannel1.2), Thermistor Channel2 (C30_ThermistorChannel2.1 D5_ThermistorChannel2.1 P2_ThermistorChannel2.2), Power (31 pins), Thermocouple Channel1 (C31_ThermocoupleChannel1.1 U4_ThermocoupleChannel1.1), Thermocouple Channel2 (C31_ThermocoupleChannel2.1 U4_ThermocoupleChannel2.1), Endstop Channel1 (C1_EndstopChannel1.2 C2_EndstopChannel1.2 MAX1_EndstopChannel1.2 MIN1_EndstopChannel1.2), Endstop Channel2 (C1_EndstopChannel2.2 C2_EndstopChannel2.2 MAX1_EndstopChannel2.2 MIN1_EndstopChannel2.2), Endstop Channel3 (C1_EndstopChannel3.2 C2_EndstopChannel3.2 MAX1_EndstopChannel3.2 MIN1_EndstopChannel3.2), Driver Channel DRV88251 (8 pins), Driver Channel DRV88252 (8 pins), Driver Channel DRV88253 (8 pins), Driver Channel DRV88254 (8 pins), Driver Channel DRV88255 (8 pins), MOSFETs and Driver (25 pins)
BED_PWM: ATSAM3X8E Main Controller (U3#1.144), MOSFETs and Driver (TP38.1 U8.7)
DIR1: ATSAM3X8E Main Controller (U3#1.87), Driver Channel DRV88251 (TP39_DriverChannelDRV88251.1 U7_DriverChannelDRV88251.20)
DIR2: ATSAM3X8E Main Controller (U3#1.94), Driver Channel DRV88252 (TP39_DriverChannelDRV88252.1 U7_DriverChannelDRV88252.20)
DIR3: ATSAM3X8E Main Controller (U3#1.103), Driver Channel DRV88253 (TP39_DriverChannelDRV88253.1 U7_DriverChannelDRV88253.20)
DIR4: ATSAM3X8E Main Controller (U3#1.116), Driver Channel DRV88254 (TP39_DriverChannelDRV88254.1 U7_DriverChannelDRV88254.20)
DIR5: ATSAM3X8E Main Controller (U3#1.123), Driver Channel DRV88255 (TP39_DriverChannelDRV88255.1 U7_DriverChannelDRV88255.20)
EN1: ATSAM3X8E Main Controller (U3#1.86), Driver Channel DRV88251 (TP32_DriverChannelDRV88251.1 U7_DriverChannelDRV88251.21)
EN2: ATSAM3X8E Main Controller (U3#1.93), Driver Channel DRV88252 (TP32_DriverChannelDRV88252.1 U7_DriverChannelDRV88252.21)
EN3: ATSAM3X8E Main Controller (U3#1.102), Driver Channel DRV88253 (TP32_DriverChannelDRV88253.1 U7_DriverChannelDRV88253.21)
EN4: ATSAM3X8E Main Controller (U3#1.115), Driver Channel DRV88254 (TP32_DriverChannelDRV88254.1 U7_DriverChannelDRV88254.21)
EN5: ATSAM3X8E Main Controller (U3#1.122), Driver Channel DRV88255 (TP32_DriverChannelDRV88255.1 U7_DriverChannelDRV88255.21)
FET_PWM1: ATSAM3X8E Main Controller (U3#1.135), MOSFETs and Driver (TP43.1 U8.1)
FET_PWM2: ATSAM3X8E Main Controller (U3#1.134), MOSFETs and Driver (TP44.1 U8.3)
FET_PWM3: ATSAM3X8E Main Controller (U3#1.133), MOSFETs and Driver (TP45.1 U8.4)
FET_PWM4: ATSAM3X8E Main Controller (U3#1.132), MOSFETs and Driver (TP46.1 U8.5)
FET_PWM5: ATSAM3X8E Main Controller (U3#1.131), MOSFETs and Driver (TP47.1 U8.6)
MAX_ES1: ATSAM3X8E Main Controller (DA1.2 U3#1.76), Endstop Channel1 (C2_EndstopChannel1.1 MAX1_EndstopChannel1.1 R3_EndstopChannel1.2 TP10_EndstopChannel1.1)
MAX_ES2: ATSAM3X8E Main Controller (DA2.2 U3#1.95), Endstop Channel2 (C2_EndstopChannel2.1 MAX1_EndstopChannel2.1 R3_EndstopChannel2.2 TP10_EndstopChannel2.1)
MAX_ES3: ATSAM3X8E Main Controller (DA3.2 U3#1.78), Endstop Channel3 (C2_EndstopChannel3.1 MAX1_EndstopChannel3.1 R3_EndstopChannel3.2 TP10_EndstopChannel3.1)
MIN_ES1: ATSAM3X8E Main Controller (DA1.1 U3#1.77), Endstop Channel1 (C1_EndstopChannel1.1 MIN1_EndstopChannel1.1 R2_EndstopChannel1.2 TP9_EndstopChannel1.1)
MIN_ES2: ATSAM3X8E Main Controller (DA2.1 U3#1.100), Endstop Channel2 (C1_EndstopChannel2.1 MIN1_EndstopChannel2.1 R2_EndstopChannel2.2 TP9_EndstopChannel2.1)
MIN_ES3: ATSAM3X8E Main Controller (DA3.1 U3#1.88), Endstop Channel3 (C1_EndstopChannel3.1 MIN1_EndstopChannel3.1 R2_EndstopChannel3.2 TP9_EndstopChannel3.1)
MISO: ATSAM3X8E Main Controller (EXP0.19 EXP2.19 TP7.1 U3#1.108), Thermocouple Channel1 (U4_ThermocoupleChannel1.7), Thermocouple Channel2 (U4_ThermocoupleChannel2.7)
MOD0E1: ATSAM3X8E Main Controller (U3#1.84), Driver Channel DRV88251 (TP37_DriverChannelDRV88251.1 U7_DriverChannelDRV88251.24)
MOD0E2: ATSAM3X8E Main Controller (U3#1.91), Driver Channel DRV88252 (TP37_DriverChannelDRV88252.1 U7_DriverChannelDRV88252.24)
MOD0E3: ATSAM3X8E Main Controller (U3#1.98), Driver Channel DRV88253 (TP37_DriverChannelDRV88253.1 U7_DriverChannelDRV88253.24)
MOD0E4: ATSAM3X8E Main Controller (U3#1.113), Driver Channel DRV88254 (TP37_DriverChannelDRV88254.1 U7_DriverChannelDRV88254.24)
MOD0E5: ATSAM3X8E Main Controller (U3#1.120), Driver Channel DRV88255 (TP37_DriverChannelDRV88255.1 U7_DriverChannelDRV88255.24)
MOD1E1: ATSAM3X8E Main Controller (U3#1.83), Driver Channel DRV88251 (TP36_DriverChannelDRV88251.1 U7_DriverChannelDRV88251.25)
MOD1E2: ATSAM3X8E Main Controller (U3#1.90), Driver Channel DRV88252 (TP36_DriverChannelDRV88252.1 U7_DriverChannelDRV88252.25)
MOD1E3: ATSAM3X8E Main Controller (U3#1.97), Driver Channel DRV88253 (TP36_DriverChannelDRV88253.1 U7_DriverChannelDRV88253.25)
MOD1E4: ATSAM3X8E Main Controller (U3#1.117), Driver Channel DRV88254 (TP36_DriverChannelDRV88254.1 U7_DriverChannelDRV88254.25)
MOD1E5: ATSAM3X8E Main Controller (U3#1.119), Driver Channel DRV88255 (TP36_DriverChannelDRV88255.1 U7_DriverChannelDRV88255.25)
MOD2E1: ATSAM3X8E Main Controller (U3#1.82), Driver Channel DRV88251 (TP35_DriverChannelDRV88251.1 U7_DriverChannelDRV88251.26)
MOD2E2: ATSAM3X8E Main Controller (U3#1.89), Driver Channel DRV88252 (TP35_DriverChannelDRV88252.1 U7_DriverChannelDRV88252.26)
MOD2E3: ATSAM3X8E Main Controller (U3#1.96), Driver Channel DRV88253 (TP35_DriverChannelDRV88253.1 U7_DriverChannelDRV88253.26)
MOD2E4: ATSAM3X8E Main Controller (U3#1.143), Driver Channel DRV88254 (TP35_DriverChannelDRV88254.1 U7_DriverChannelDRV88254.26)
MOD2E5: ATSAM3X8E Main Controller (U3#1.118), Driver Channel DRV88255 (TP35_DriverChannelDRV88255.1 U7_DriverChannelDRV88255.26)
OVREF: Thermistor Channel1 (D3_ThermistorChannel1.2), Thermistor Channel2 (D3_ThermistorChannel2.2), Power (D1.2 R1.1 TP2.1)
REF1: ATSAM3X8E Main Controller (U3#1.63), Driver Channel DRV88251 (R31_DriverChannelDRV88251.2 TP33_DriverChannelDRV88251.1)
REF2: ATSAM3X8E Main Controller (U3#1.64), Driver Channel DRV88252 (R31_DriverChannelDRV88252.2 TP33_DriverChannelDRV88252.1)
REF3: ATSAM3X8E Main Controller (U3#1.65), Driver Channel DRV88253 (R31_DriverChannelDRV88253.2 TP33_DriverChannelDRV88253.1)
REF4: ATSAM3X8E Main Controller (U3#1.66), Driver Channel DRV88254 (R31_DriverChannelDRV88254.2 TP33_DriverChannelDRV88254.1)
REF5: ATSAM3X8E Main Controller (U3#1.67), Driver Channel DRV88255 (R31_DriverChannelDRV88255.2 TP33_DriverChannelDRV88255.1)
SCLK: ATSAM3X8E Main Controller (EXP0.2 EXP2.2 TP6.1 U3#1.110), Thermocouple Channel1 (U4_ThermocoupleChannel1.5), Thermocouple Channel2 (U4_ThermocoupleChannel2.5)
STEP1: ATSAM3X8E Main Controller (U3#1.85), Driver Channel DRV88251 (TP40_DriverChannelDRV88251.1 U7_DriverChannelDRV88251.22)
STEP2: ATSAM3X8E Main Controller (U3#1.92), Driver Channel DRV88252 (TP40_DriverChannelDRV88252.1 U7_DriverChannelDRV88252.22)
STEP3: ATSAM3X8E Main Controller (U3#1.99), Driver Channel DRV88253 (TP40_DriverChannelDRV88253.1 U7_DriverChannelDRV88253.22)
STEP4: ATSAM3X8E Main Controller (U3#1.114), Driver Channel DRV88254 (TP40_DriverChannelDRV88254.1 U7_DriverChannelDRV88254.22)
STEP5: ATSAM3X8E Main Controller (U3#1.121), Driver Channel DRV88255 (TP40_DriverChannelDRV88255.1 U7_DriverChannelDRV88255.22)
TC_CS1: ATSAM3X8E Main Controller (TP4.1 U3#1.111), Thermocouple Channel1 (U4_ThermocoupleChannel1.6)
TC_CS2: ATSAM3X8E Main Controller (TP5.1 U3#1.112), Thermocouple Channel2 (U4_ThermocoupleChannel2.6)
THERM_AN1: ATSAM3X8E Main Controller (U3#1.128 U5.4), Thermistor Channel1 (5 pins)
THERM_AN2: ATSAM3X8E Main Controller (U3#1.129 U5.3), Thermistor Channel2 (5 pins)